# Altium project EEM_FMC_Carrier.PrjPCB (part 1 of 9)
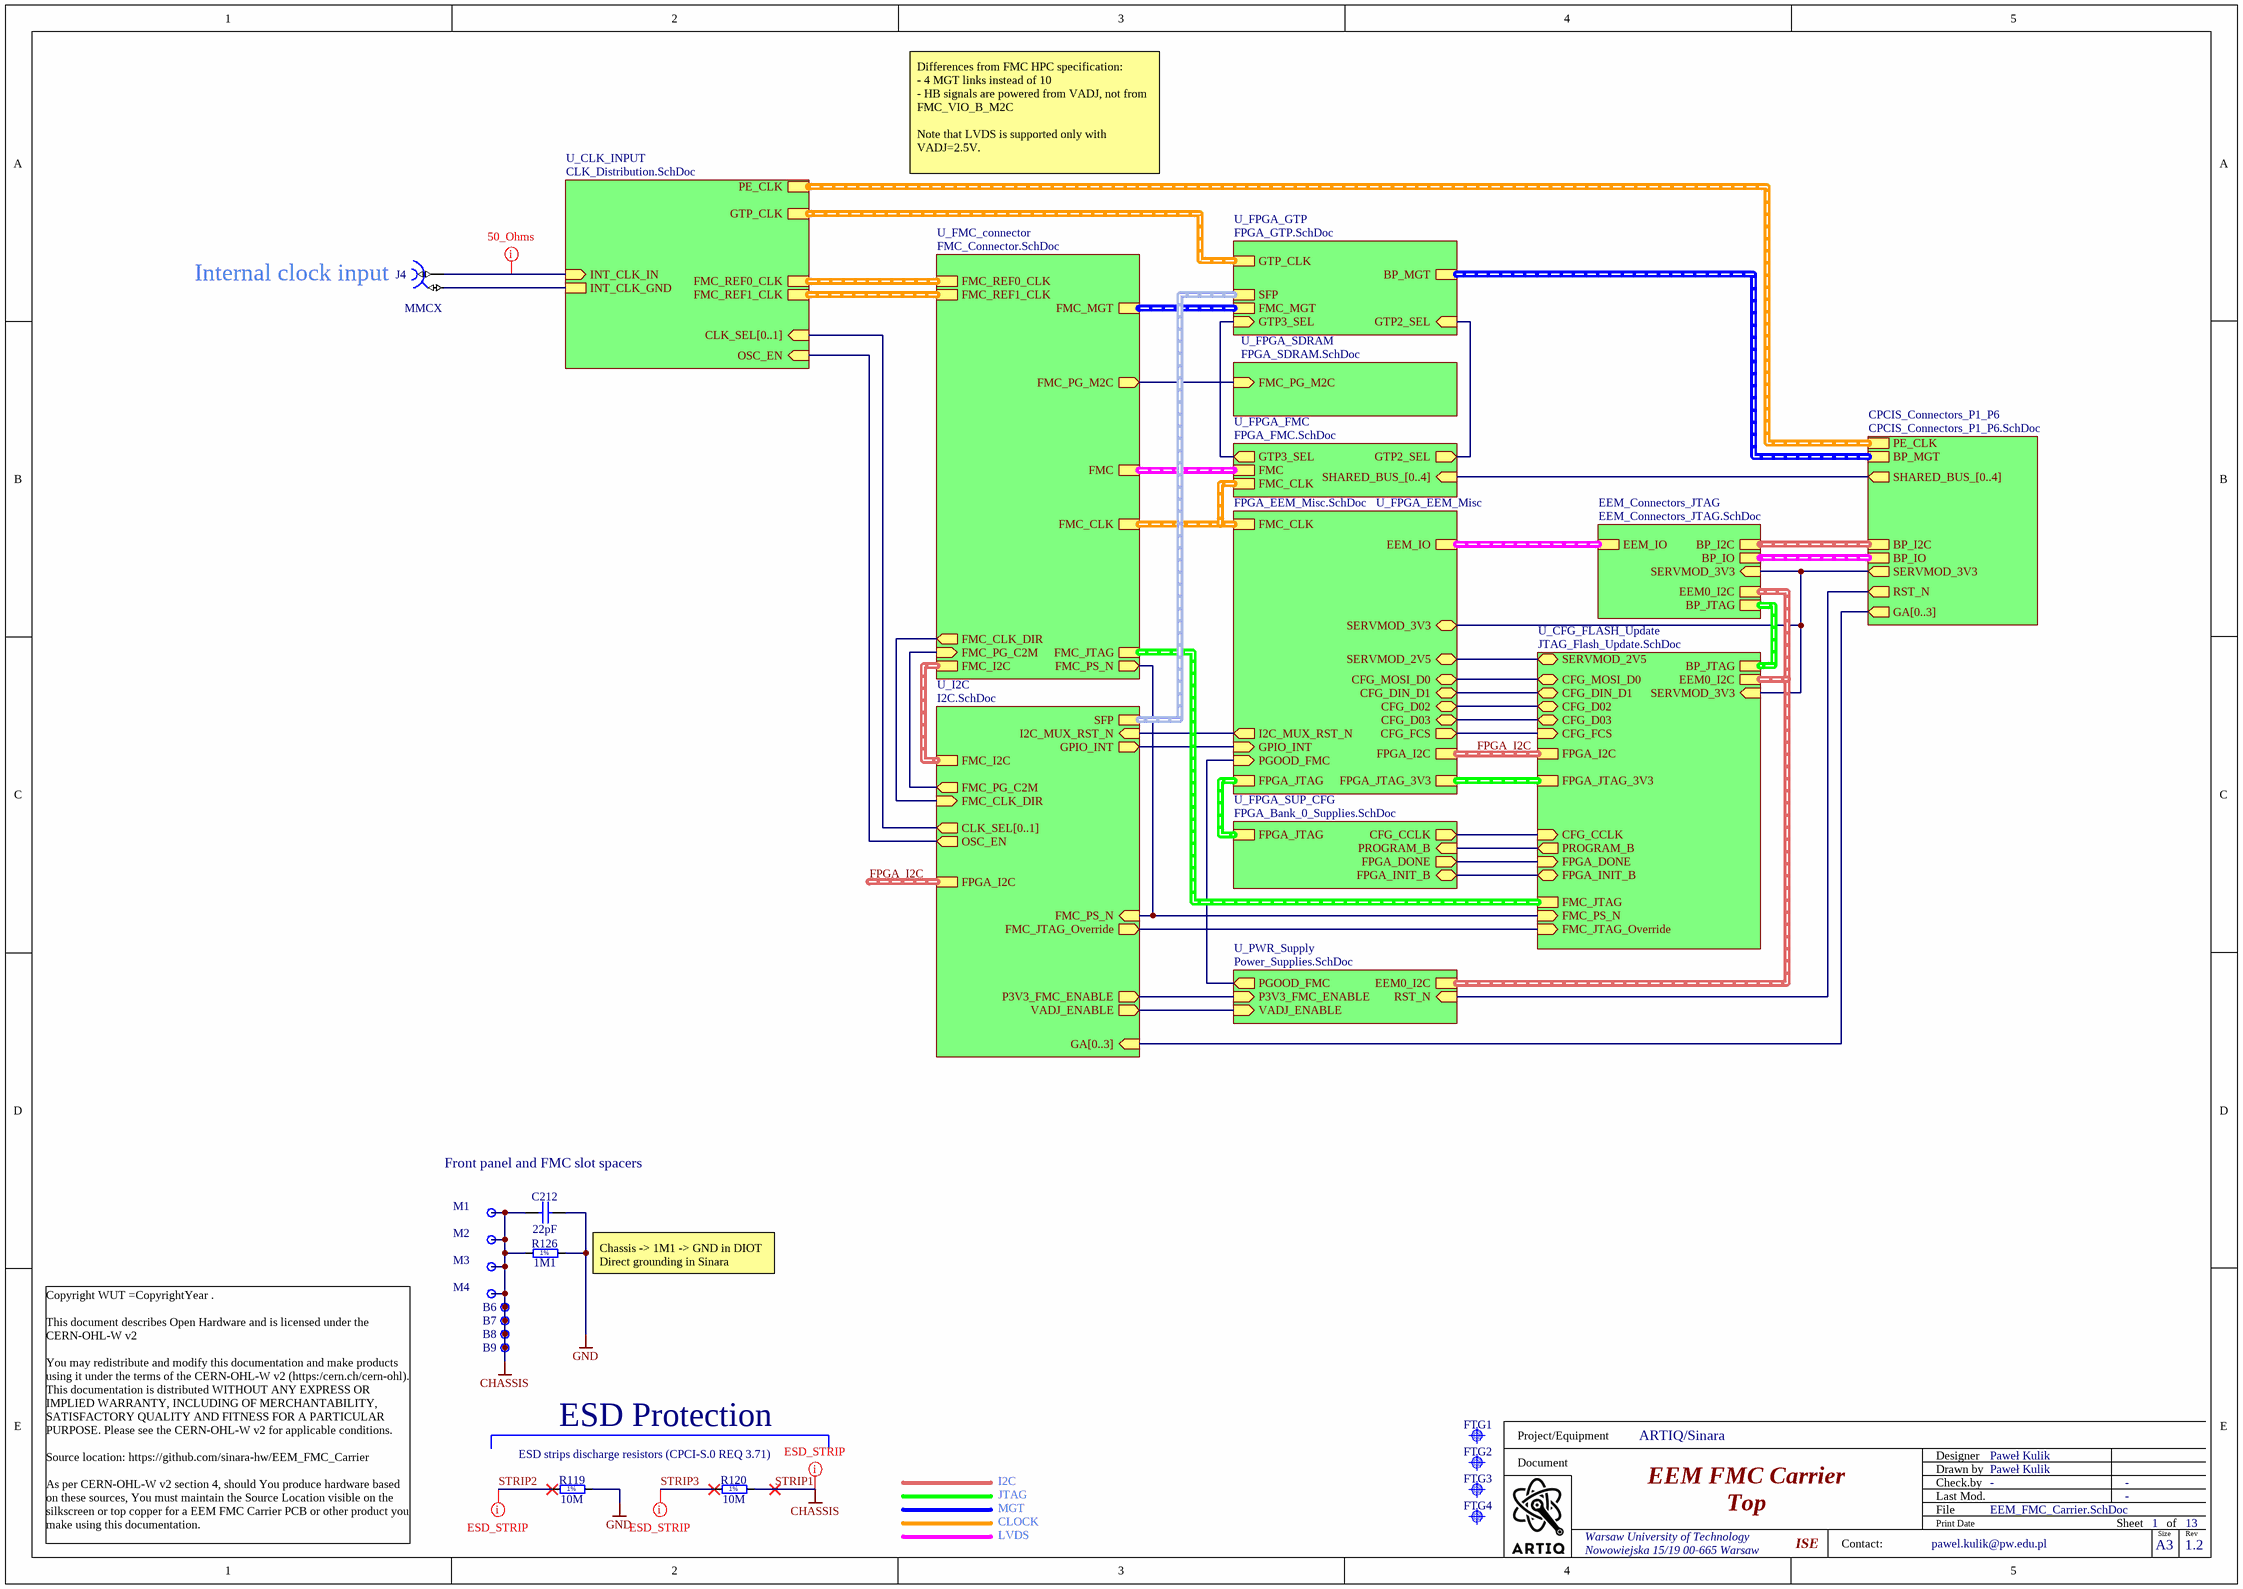
[diagram p0: EEM_FMC_Carrier.SchDoc]
CopyrightYear: 2025; Version: 1.2; Title: EEM FMC Carrier; SheetTotal: 13; P_version: 1.2; Projet: ARTIQ/Sinara; Project1: EEM FMC Carrier; DrawnBy: Paweł Kulik; DivGrp: ISE; Designer: Paweł Kulik; CheckedDate: -; CheckedBy: -; Address3: pawel.kulik@pw.edu.pl; Address2: Nowowiejska 15/19 00-665 Warsaw; Address1: Warsaw University of Technology
13 sheets, 778 parts. Net scope: hierarchical (ports join the sheet entries above them; power ports are global).
Board file: EEM_FMC_Carrier.PcbDoc
Sheets:
  EEM_FMC_Carrier.SchDoc
    U_FPGA_EEM_Misc = FPGA_EEM_Misc.SchDoc
    U_PWR_Supply = Power_Supplies.SchDoc
    U_CLK_INPUT = CLK_Distribution.SchDoc
    U_FPGA_FMC = FPGA_FMC.SchDoc
    U_FPGA_SUP_CFG = FPGA_Bank_0_Supplies.SchDoc
    U_FPGA_GTP = FPGA_GTP.SchDoc
    U_FPGA_SDRAM = FPGA_SDRAM.SchDoc
    U_CFG_FLASH_Update = JTAG_Flash_Update.SchDoc
    U_FMC_connector = FMC_Connector.SchDoc
    CPCIS_Connectors_P1_P6 = CPCIS_Connectors_P1_P6.SchDoc
    EEM_Connectors_JTAG = EEM_Connectors_JTAG.SchDoc
    U_I2C = I2C.SchDoc

## Sheet EEM_FMC_Carrier.SchDoc: EEM FMC Carrier
size 420 x 297 mm; EDA_Number: ARTIQ; Projet: ARTIQ/Sinara; CheckedBy: -; CompanyName: WUT ISE; DrawnBy: Paweł Kulik; Organization: WUT ISE; Address1: Warsaw University of Technology; Address2: Nowowiejska 15/19 00-665 Warsaw; Address3: pawel.kulik@pw.edu.pl; DocumentNumber: 1; SheetNumber: 1; SheetTotal: 13; CheckedDate: -; Title2: Top; DivGrp: ISE; Designer: Paweł Kulik; ModifiedDate: -

### Parts
B6  Plated Hole  [MTG270_500]  (value not drawn)  (no BOM)
B7  Plated Hole  [MTG270_500]  (value not drawn)  (no BOM)
B8  Plated Hole  [MTG270_500]  (value not drawn)  (no BOM)
B9  Plated Hole  [MTG270_500]  (value not drawn)  (no BOM)
C212  22pF  [CAPC1005X55N]
FTG1  Use only in PCB  [FIDUCIAL_TOP_C100-200]  (value not drawn)
FTG2  Use only in PCB  [FIDUCIAL_TOP_S100-200]  (value not drawn)
FTG3  Use only in PCB  [FIDUCIAL_TOP_S100-200]  (value not drawn)
FTG4  Use only in PCB  [FIDUCIAL_TOP_S100-200]  (value not drawn)
J4  MMCX  [SAMTEC_MMCX-J-P-H-ST-TH1]
M1  Plated Hole  [MTG300_600]  (value not drawn)  (no BOM)
M2  Plated Hole  [MTG300_600]  (value not drawn)  (no BOM)
M3  Plated Hole  [MTG300_600]  (value not drawn)  (no BOM)
M4  Plated Hole  [MTG300_600]  (value not drawn)  (no BOM)
R119  10M  [RESC2113X55N]
R120  10M  [RESC2113X55N]
R126  1M1  [RESC2012X60N]

### Sub-sheets
CPCIS_Connectors_P1_P6 = CPCIS_Connectors_P1_P6.SchDoc: BP_I2C (harness I2C), SERVMOD_3V3 (out), RST_N (out), PE_CLK (harness CLK_DIFF), BP_MGT (harness MGT), GA[0..3] (out), BP_IO (harness EEM_LVDS), SHARED_BUS_[0..4] (out)
EEM_Connectors_JTAG = EEM_Connectors_JTAG.SchDoc: BP_JTAG (harness JTAG5), EEM_IO (harness EEM_LVDS), BP_IO (harness EEM_LVDS), EEM0_I2C (harness I2C), BP_I2C (harness I2C), SERVMOD_3V3 (in)
U_CFG_FLASH_Update = JTAG_Flash_Update.SchDoc: CFG_MOSI_D0 (bidir), CFG_DIN_D1 (bidir), CFG_D02 (bidir), CFG_D03 (bidir), CFG_FCS (in), CFG_CCLK (in), FPGA_DONE (in), FPGA_INIT_B (bidir), PROGRAM_B (out), SERVMOD_3V3 (in), EEM0_I2C (harness I2C), FMC_PS_N (in), FMC_JTAG_Override (in), FPGA_JTAG_3V3 (harness JTAG5), BP_JTAG (harness JTAG5), FMC_JTAG (harness JTAG5), FPGA_I2C (harness I2C), SERVMOD_2V5 (bidir)
U_CLK_INPUT = CLK_Distribution.SchDoc: INT_CLK_IN (in), INT_CLK_GND, PE_CLK (harness CLK_DIFF), FMC_REF1_CLK (harness CLK_DIFF), FMC_REF0_CLK (harness CLK_DIFF), GTP_CLK (harness CLK_DIFF), CLK_SEL[0..1] (in), OSC_EN (in)
U_FMC_connector = FMC_Connector.SchDoc: FMC_REF1_CLK (harness CLK_DIFF), FMC_REF0_CLK (harness CLK_DIFF), FMC_CLK (harness FMC_CLK), FMC_PG_M2C (out), FMC_I2C (harness I2C), FMC_MGT (harness FMC_MGT), FMC_JTAG (harness JTAG5), FMC (harness FMC), FMC_PS_N (out), FMC_PG_C2M (in), FMC_CLK_DIR (out)
U_FPGA_EEM_Misc = FPGA_EEM_Misc.SchDoc: CFG_DIN_D1 (bidir), CFG_FCS (out), CFG_MOSI_D0 (bidir), CFG_D02 (bidir), CFG_D03 (bidir), FMC_CLK (harness FMC_CLK), EEM_IO (harness EEM_LVDS), FPGA_I2C (harness I2C), PGOOD_FMC (in), FPGA_JTAG (harness JTAG5), FPGA_JTAG_3V3 (harness JTAG5), SERVMOD_2V5 (bidir), SERVMOD_3V3 (bidir), I2C_MUX_RST_N (out), GPIO_INT (in)
U_FPGA_FMC = FPGA_FMC.SchDoc: FMC (harness FMC), FMC_CLK (harness FMC_CLK), SHARED_BUS_[0..4] (in), GTP3_SEL (out), GTP2_SEL (out)
U_FPGA_GTP = FPGA_GTP.SchDoc: FMC_MGT (harness FMC_MGT), BP_MGT (harness MGT), GTP_CLK (harness CLK_DIFF), GTP3_SEL (in), SFP (harness SFP), GTP2_SEL (in)
U_FPGA_SDRAM = FPGA_SDRAM.SchDoc: FMC_PG_M2C (in)
U_FPGA_SUP_CFG = FPGA_Bank_0_Supplies.SchDoc: FPGA_INIT_B (bidir), FPGA_DONE (out), CFG_CCLK (out), PROGRAM_B (in), FPGA_JTAG (harness JTAG5)
U_I2C = I2C.SchDoc: FMC_CLK_DIR (in), FMC_I2C (harness I2C), FMC_PS_N (in), FMC_PG_C2M (out), CLK_SEL[0..1] (out), GA[0..3] (in), FPGA_I2C (harness I2C), FMC_JTAG_Override (out), P3V3_FMC_ENABLE (out), VADJ_ENABLE (out), OSC_EN (out), SFP (harness SFP), I2C_MUX_RST_N (in), GPIO_INT (out)
U_PWR_Supply = Power_Supplies.SchDoc: RST_N (in), VADJ_ENABLE (in), P3V3_FMC_ENABLE (in), PGOOD_FMC (out), EEM0_I2C (harness I2C)

### Nets
GND: C212.2 R119.2 R126.2
STRIP1: B6.1 B7.1 B8.1 B9.1 C212.1 M1.1 M2.1 M3.1 M4.1 R120.2 R126.1  [also labelled CHASSIS]
CFG_CCLK: sheet U_FPGA_SUP_CFG/CFG_CCLK, sheet U_CFG_FLASH_Update/CFG_CCLK
CFG_D02: sheet U_FPGA_EEM_Misc/CFG_D02, sheet U_CFG_FLASH_Update/CFG_D02
CFG_D03: sheet U_FPGA_EEM_Misc/CFG_D03, sheet U_CFG_FLASH_Update/CFG_D03
CFG_DIN_D1: sheet U_FPGA_EEM_Misc/CFG_DIN_D1, sheet U_CFG_FLASH_Update/CFG_DIN_D1
CFG_FCS: sheet U_FPGA_EEM_Misc/CFG_FCS, sheet U_CFG_FLASH_Update/CFG_FCS
CFG_MOSI_D0: sheet U_FPGA_EEM_Misc/CFG_MOSI_D0, sheet U_CFG_FLASH_Update/CFG_MOSI_D0
FMC_CLK_DIR: sheet U_FMC_connector/FMC_CLK_DIR, sheet U_I2C/FMC_CLK_DIR
FMC_JTAG_Override: sheet U_CFG_FLASH_Update/FMC_JTAG_Override, sheet U_I2C/FMC_JTAG_Override
FMC_PG_C2M: sheet U_FMC_connector/FMC_PG_C2M, sheet U_I2C/FMC_PG_C2M
FMC_PG_M2C: sheet U_FPGA_SDRAM/FMC_PG_M2C, sheet U_FMC_connector/FMC_PG_M2C
FMC_PS_N: sheet U_CFG_FLASH_Update/FMC_PS_N, sheet U_FMC_connector/FMC_PS_N, sheet U_I2C/FMC_PS_N
FPGA_DONE: sheet U_FPGA_SUP_CFG/FPGA_DONE, sheet U_CFG_FLASH_Update/FPGA_DONE
FPGA_INIT_B: sheet U_FPGA_SUP_CFG/FPGA_INIT_B, sheet U_CFG_FLASH_Update/FPGA_INIT_B
GPIO_INT: sheet U_FPGA_EEM_Misc/GPIO_INT, sheet U_I2C/GPIO_INT
GTP2_SEL: sheet U_FPGA_FMC/GTP2_SEL, sheet U_FPGA_GTP/GTP2_SEL
GTP3_SEL: sheet U_FPGA_FMC/GTP3_SEL, sheet U_FPGA_GTP/GTP3_SEL
I2C_MUX_RST_N: sheet U_FPGA_EEM_Misc/I2C_MUX_RST_N, sheet U_I2C/I2C_MUX_RST_N
OSC_EN: sheet U_CLK_INPUT/OSC_EN, sheet U_I2C/OSC_EN
P3V3_FMC_ENABLE: sheet U_PWR_Supply/P3V3_FMC_ENABLE, sheet U_I2C/P3V3_FMC_ENABLE
PGOOD_FMC: sheet U_FPGA_EEM_Misc/PGOOD_FMC, sheet U_PWR_Supply/PGOOD_FMC
PROGRAM_B: sheet U_FPGA_SUP_CFG/PROGRAM_B, sheet U_CFG_FLASH_Update/PROGRAM_B
RST_N: sheet U_PWR_Supply/RST_N, sheet CPCIS_Connectors_P1_P6/RST_N
SERVMOD_2V5: sheet U_FPGA_EEM_Misc/SERVMOD_2V5, sheet U_CFG_FLASH_Update/SERVMOD_2V5
SERVMOD_3V3: sheet U_FPGA_EEM_Misc/SERVMOD_3V3, sheet U_CFG_FLASH_Update/SERVMOD_3V3, sheet CPCIS_Connectors_P1_P6/SERVMOD_3V3, sheet EEM_Connectors_JTAG/SERVMOD_3V3
STRIP2: R119.1
STRIP3: R120.1
VADJ_ENABLE: sheet U_PWR_Supply/VADJ_ENABLE, sheet U_I2C/VADJ_ENABLE
NetC3_1: J4.1 ; sheet U_CLK_INPUT/INT_CLK_IN
NetJ4_2: J4.2 ; sheet U_CLK_INPUT/INT_CLK_GND

### Buses and harness runs
bus sheet CPCIS_Connectors_P1_P6/GA[0..3] = sheet U_I2C/GA[0..3]
bus sheet CPCIS_Connectors_P1_P6/SHARED_BUS_[0..4] = sheet U_FPGA_FMC/SHARED_BUS_[0..4]
bus sheet U_CLK_INPUT/CLK_SEL[0..1] = sheet U_I2C/CLK_SEL[0..1]
harness FPGA_I2C = sheet U_CFG_FLASH_Update/FPGA_I2C = sheet U_FPGA_EEM_Misc/FPGA_I2C
harness FPGA_I2C = sheet U_I2C/FPGA_I2C
harness sheet CPCIS_Connectors_P1_P6/BP_I2C = sheet EEM_Connectors_JTAG/BP_I2C
harness sheet CPCIS_Connectors_P1_P6/BP_IO = sheet EEM_Connectors_JTAG/BP_IO
harness sheet CPCIS_Connectors_P1_P6/BP_MGT = sheet U_FPGA_GTP/BP_MGT
harness sheet CPCIS_Connectors_P1_P6/PE_CLK = sheet U_CLK_INPUT/PE_CLK
harness sheet EEM_Connectors_JTAG/BP_JTAG = sheet U_CFG_FLASH_Update/BP_JTAG
harness sheet EEM_Connectors_JTAG/EEM0_I2C = sheet U_CFG_FLASH_Update/EEM0_I2C = sheet U_PWR_Supply/EEM0_I2C
harness sheet EEM_Connectors_JTAG/EEM_IO = sheet U_FPGA_EEM_Misc/EEM_IO
harness sheet U_CFG_FLASH_Update/FMC_JTAG = sheet U_FMC_connector/FMC_JTAG
harness sheet U_CFG_FLASH_Update/FPGA_JTAG_3V3 = sheet U_FPGA_EEM_Misc/FPGA_JTAG_3V3
harness sheet U_CLK_INPUT/FMC_REF0_CLK = sheet U_FMC_connector/FMC_REF0_CLK
harness sheet U_CLK_INPUT/FMC_REF1_CLK = sheet U_FMC_connector/FMC_REF1_CLK
harness sheet U_CLK_INPUT/GTP_CLK = sheet U_FPGA_GTP/GTP_CLK
harness sheet U_FMC_connector/FMC = sheet U_FPGA_FMC/FMC
harness sheet U_FMC_connector/FMC_CLK = sheet U_FPGA_EEM_Misc/FMC_CLK = sheet U_FPGA_FMC/FMC_CLK
harness sheet U_FMC_connector/FMC_I2C = sheet U_I2C/FMC_I2C
harness sheet U_FMC_connector/FMC_MGT = sheet U_FPGA_GTP/FMC_MGT
harness sheet U_FPGA_EEM_Misc/FPGA_JTAG = sheet U_FPGA_SUP_CFG/FPGA_JTAG
harness sheet U_FPGA_GTP/SFP = sheet U_I2C/SFP

### Layout directives
net class 50Ohm: NetC3_1
net class ESD_STRIP: STRIP1, STRIP2, STRIP3

### Notes on the sheet
- Differences from FMC HPC specification:
  - 4 MGT links instead of 10
  - HB signals are powered from VADJ, not from FMC_VIO_B_M2C
  Note that LVDS is supported only with VADJ=2.5V.
- (near J4) Internal clock input
- Front panel and FMC slot spacers
- Chassis -> 1M1 -> GND in DIOT
  Direct grounding in Sinara
- ESD strips discharge resistors (CPCI-S.0 REQ 3.71)
- ESD Protection
- I2C
- JTAG
- MGT
- CLOCK
- LVDS
- Project/Equipment
- Document
- Designer
- Drawn by
- Check.by
- Copyright WUT =CopyrightYear .
  This document describes Open Hardware and is licensed under the CERN-OHL-W v2
  You may redistribute and modify this documentation and make products using it under the terms of the CERN-OHL-W v2 (https:/cern.ch/cern-ohl). This documentation is distributed WITHOUT ANY EXPRESS OR IMPLIED WARRANTY, INCLUDING OF MERCHANTABILITY, SATISFACTORY QUALITY AND FITNESS FOR A PARTICULAR PURPOSE. Please see the CERN-OHL-W v2 for applicable conditions.
  Source location: https://github.com/sinara-hw/EEM_FMC_Carrier
  As per CERN-OHL-W v2 section 4, should You produce hardware based on these sources, You must maintain the Source Location visible on the silkscreen or top copper for a EEM FMC Carrier PCB or other product you make using this documentation.
- Contact:
- File
- Last Mod.
- Print Date
- Sheet
- Size
- A3
- of
- Rev
- (in symbol R0805_1M1_1%_0.125W_100PPM) 1%
- (in symbol R0805_10M_1%_0.125W_100PPM_VISHAY_CRCW e3) 1%

### Library data of the parts
B6-B9 = PLATED_HOLE2.7_PAD5.0: Single Terminal Socket; Part Description: Plated Through Hole: Hole Dia.=2.7mm Pad Dia.=5.0mm; Mounted: No; Part Number: PLATED_HOLE2.7_PAD5.0; Component Type: Standard (No BOM); Pin Count: 1; Family: Plated Hole; Socket: No; SMD: No; Sense: No; Status: None; ComponentHeight: 0mm; HelpURL: Undefined; Author: CERN DEM JMW; CreateDate: 27.09.2011; LatestRevisionDate: 27.09.2011; PackageDescription: Plated Through Hole: Hole Dia.=2.7mm Pad Dia.=5.0mm
C212 = CC0402_22PF_50V_5%_C0G: Non-polarised capacitor; Part Description: SMD Multilayer Chip Ceramic Capacitor; Manufacturer: GENERIC; Manufacturer1 Part Number: C0402C220J5GACTU; Voltage: 50V; TC: C0G/NP0; Tolerance: ±5%; Part Number: CC0402_22PF_50V_5%_C0G; Component Kind: Standard; Component Type: Standard; Pin Count: 2; Value: 22pF; Status: Preferred; Manufacturer Part Number: CC0402_22PF_50V_5%_C0G; Case: 0402; Mounted: Yes; Socket: No; SMD: Yes; Manufacturer1 Example: KEMET; Manufacturer1 ComponentHeight: 0.55mm; HelpURL: \\cern.ch\dfs\Applications\Altium\Datasheets\CC0402_C0G_KEMET_(Commercial Grade).pdf; Author: CERN DEM JLC; CreateDate: 2007-12-03; LatestRevisionDate: 2007-12-03; Sense: No
FTG1 = FIDUCIAL_TARGET_C100-200: Fiducial Target; Part Description: Round Fiducial Target, Top Layer, 1.0mm, Top Solder 2.0mm, Keepout =2.0mm; Mounted: No; Part Number: FIDUCIAL_TARGET_C100-200; Component Kind: Standard (No BOM); Component Type: Standard (No BOM); Pin Count: 1; Family: Fiducial; Socket: No; SMD: Yes; Sense: No; Status: None; ComponentHeight: 0mm; HelpURL: Undefined; Author: CERN DEM JLC; CreateDate: 09.02.2010; LatestRevisionDate: 04.04.2012; PackageDescription: Round Fiducial Target, Top Layer, 1.0mm, Top Solder 2.0mm, Keepout =2.0mm
FTG2-FTG4 = FIDUCIAL_TARGET_S100-200: Fiducial Target; Part Description: Square Fiducial Target, Top Layer, 1.0mm, Top Solder 2.0mm, Keepout =2.0mm; Mounted: No; Part Number: FIDUCIAL_TARGET_S100-200; Component Kind: Standard (No BOM); Component Type: Standard (No BOM); Pin Count: 1; Family: Fiducial; Socket: No; SMD: Yes; Sense: No; Status: None; ComponentHeight: 0mm; HelpURL: Undefined; Author: CERN DEM JLC; CreateDate: 09.02.2010; LatestRevisionDate: 04.04.2012; PackageDescription: Square Fiducial Target, Top Layer, 1.0mm, Top Solder 2.0mm, Keepout =2.0mm
J4 = SAMTEC_MMCX-J-P-H-ST-TH1: Part Description: Straight Through-hole 50 Ohm Micro Mini RF Jack, MMCX Series; Manufacturer: SAMTEC; PressFit: No; Part Number: SAMTEC_MMCX-J-P-H-ST-TH1; Component Kind: Standard; Component Type: Standard; Pin Count: 2; Mounted: Yes; Socket: No; Sense: No; SMD: No; Status: None; Manufacturer Part Number: MMCX-J-P-H-ST-TH1; ComponentHeight: 4.35mm; HelpURL: \\cern.ch\dfs\Applications\Altium\Datasheets\SAMTEC_MMCX-J-P-H-ST-TH1.pdf; Author: CERN DEM JLC; CreateDate: 05.12.2012; LatestRevisionDate: 05.12.2012
M1-M4 = PLATED_HOLE3.0_PAD6.0: Single Terminal Socket; Part Description: Plated Through Hole: Hole Dia.=3.0mm Pad Dia.=6.0mm; Mounted: No; Table: Pads; Part Number: PLATED_HOLE3.0_PAD6.0; Component Type: Standard (No BOM); Designator: Single Terminal Socket; Library Reference: Single Terminal Socket; Pin Count: 1; Family: Plated Hole; Socket: No; SMD: No; Status: None; ComponentHeight: 0mm; Author: CERN DEM JLC; CreateDate: 26.05.2008; LatestRevisionDate: 26.05.2008; PackageDescription: Plated Through Hole: Hole Dia.=3.0mm Pad Dia.=6.0mm
R119 R120 = R0805_10M_1%_0.125W_100PPM_VISHAY_CRCW e3: Resistor - 1%; Part Description: 150V, Standard Thick Film Chip Resistor; Manufacturer: VISHAY DALE; Manufacturer Part Number: CRCW080510M0FKEA; Power: 0.125W; TC: ±100ppm/°C; PressFit: No; Part Number: R0805_10M_1%_0.125W_100PPM_VISHAY_CRCW e3; Component Kind: Standard; Component Type: Standard; Pin Count: 2; Value: 10M; Status: None; Tolerance: ±1%; Case: 0805; Mounted: Yes; Sense: No; Socket: No; SMD: Yes; ComponentHeight: 0.5mm; HelpURL: \\cern.ch\dfs\Applications\Altium\Datasheets\R0805_VISHAY_CRCW e3.pdf; Author: CERN DEM BC; CreateDate: 2019-11-12; LatestRevisionDate: 2019-11-12
R126 = R0805_1M1_1%_0.125W_100PPM: Resistor - 1%; Part Description: General Purpose Thick Film Chip Resistor; Manufacturer: GENERIC; Manufacturer1 Part Number: NRC10F1104TRF; PressFit: No; Part Number: R0805_1M1_1%_0.125W_100PPM; Component Kind: Standard; Component Type: Standard; Pin Count: 2; Value: 1M1; Status: Preferred; Manufacturer Part Number: R0805_1M1_1%_0.125W_100PPM; Case: 0805; Mounted: Yes; Sense: No; Socket: No; SMD: Yes; Manufacturer1 Example: NIC COMPONENT; Manufacturer1 ComponentHeight: 0.6mm; HelpURL: \\cern.ch\dfs\Applications\Altium\Datasheets\R0805_NIC_NRC.pdf; Author: CERN DEM JLC; CreateDate: 03/12/2007; LatestRevisionDate: 13/03/2008

## Sheet FPGA_EEM_Misc.SchDoc: EEM FMC Carrier
size 420 x 297 mm; EDA_Number: ARTIQ; Projet: ARTIQ/Sinara; CheckedBy: -; CompanyName: WUT ISE; DrawnBy: Paweł Kulik; Organization: WUT ISE; Address1: Warsaw University of Technology; Address2: Nowowiejska 15/19 00-665 Warsaw; Address3: pawel.kulik@pw.edu.pl; DocumentNumber: 18; SheetNumber: 6; SheetTotal: 13; ModifiedBy: -; CheckedDate: -; Title2: FPGA EEM/BP + MISC; DivGrp: ISE; Designer: Paweł Kulik; ModifiedDate: -; ProjectName: EEM_FMC_Carrier.PrjPCB
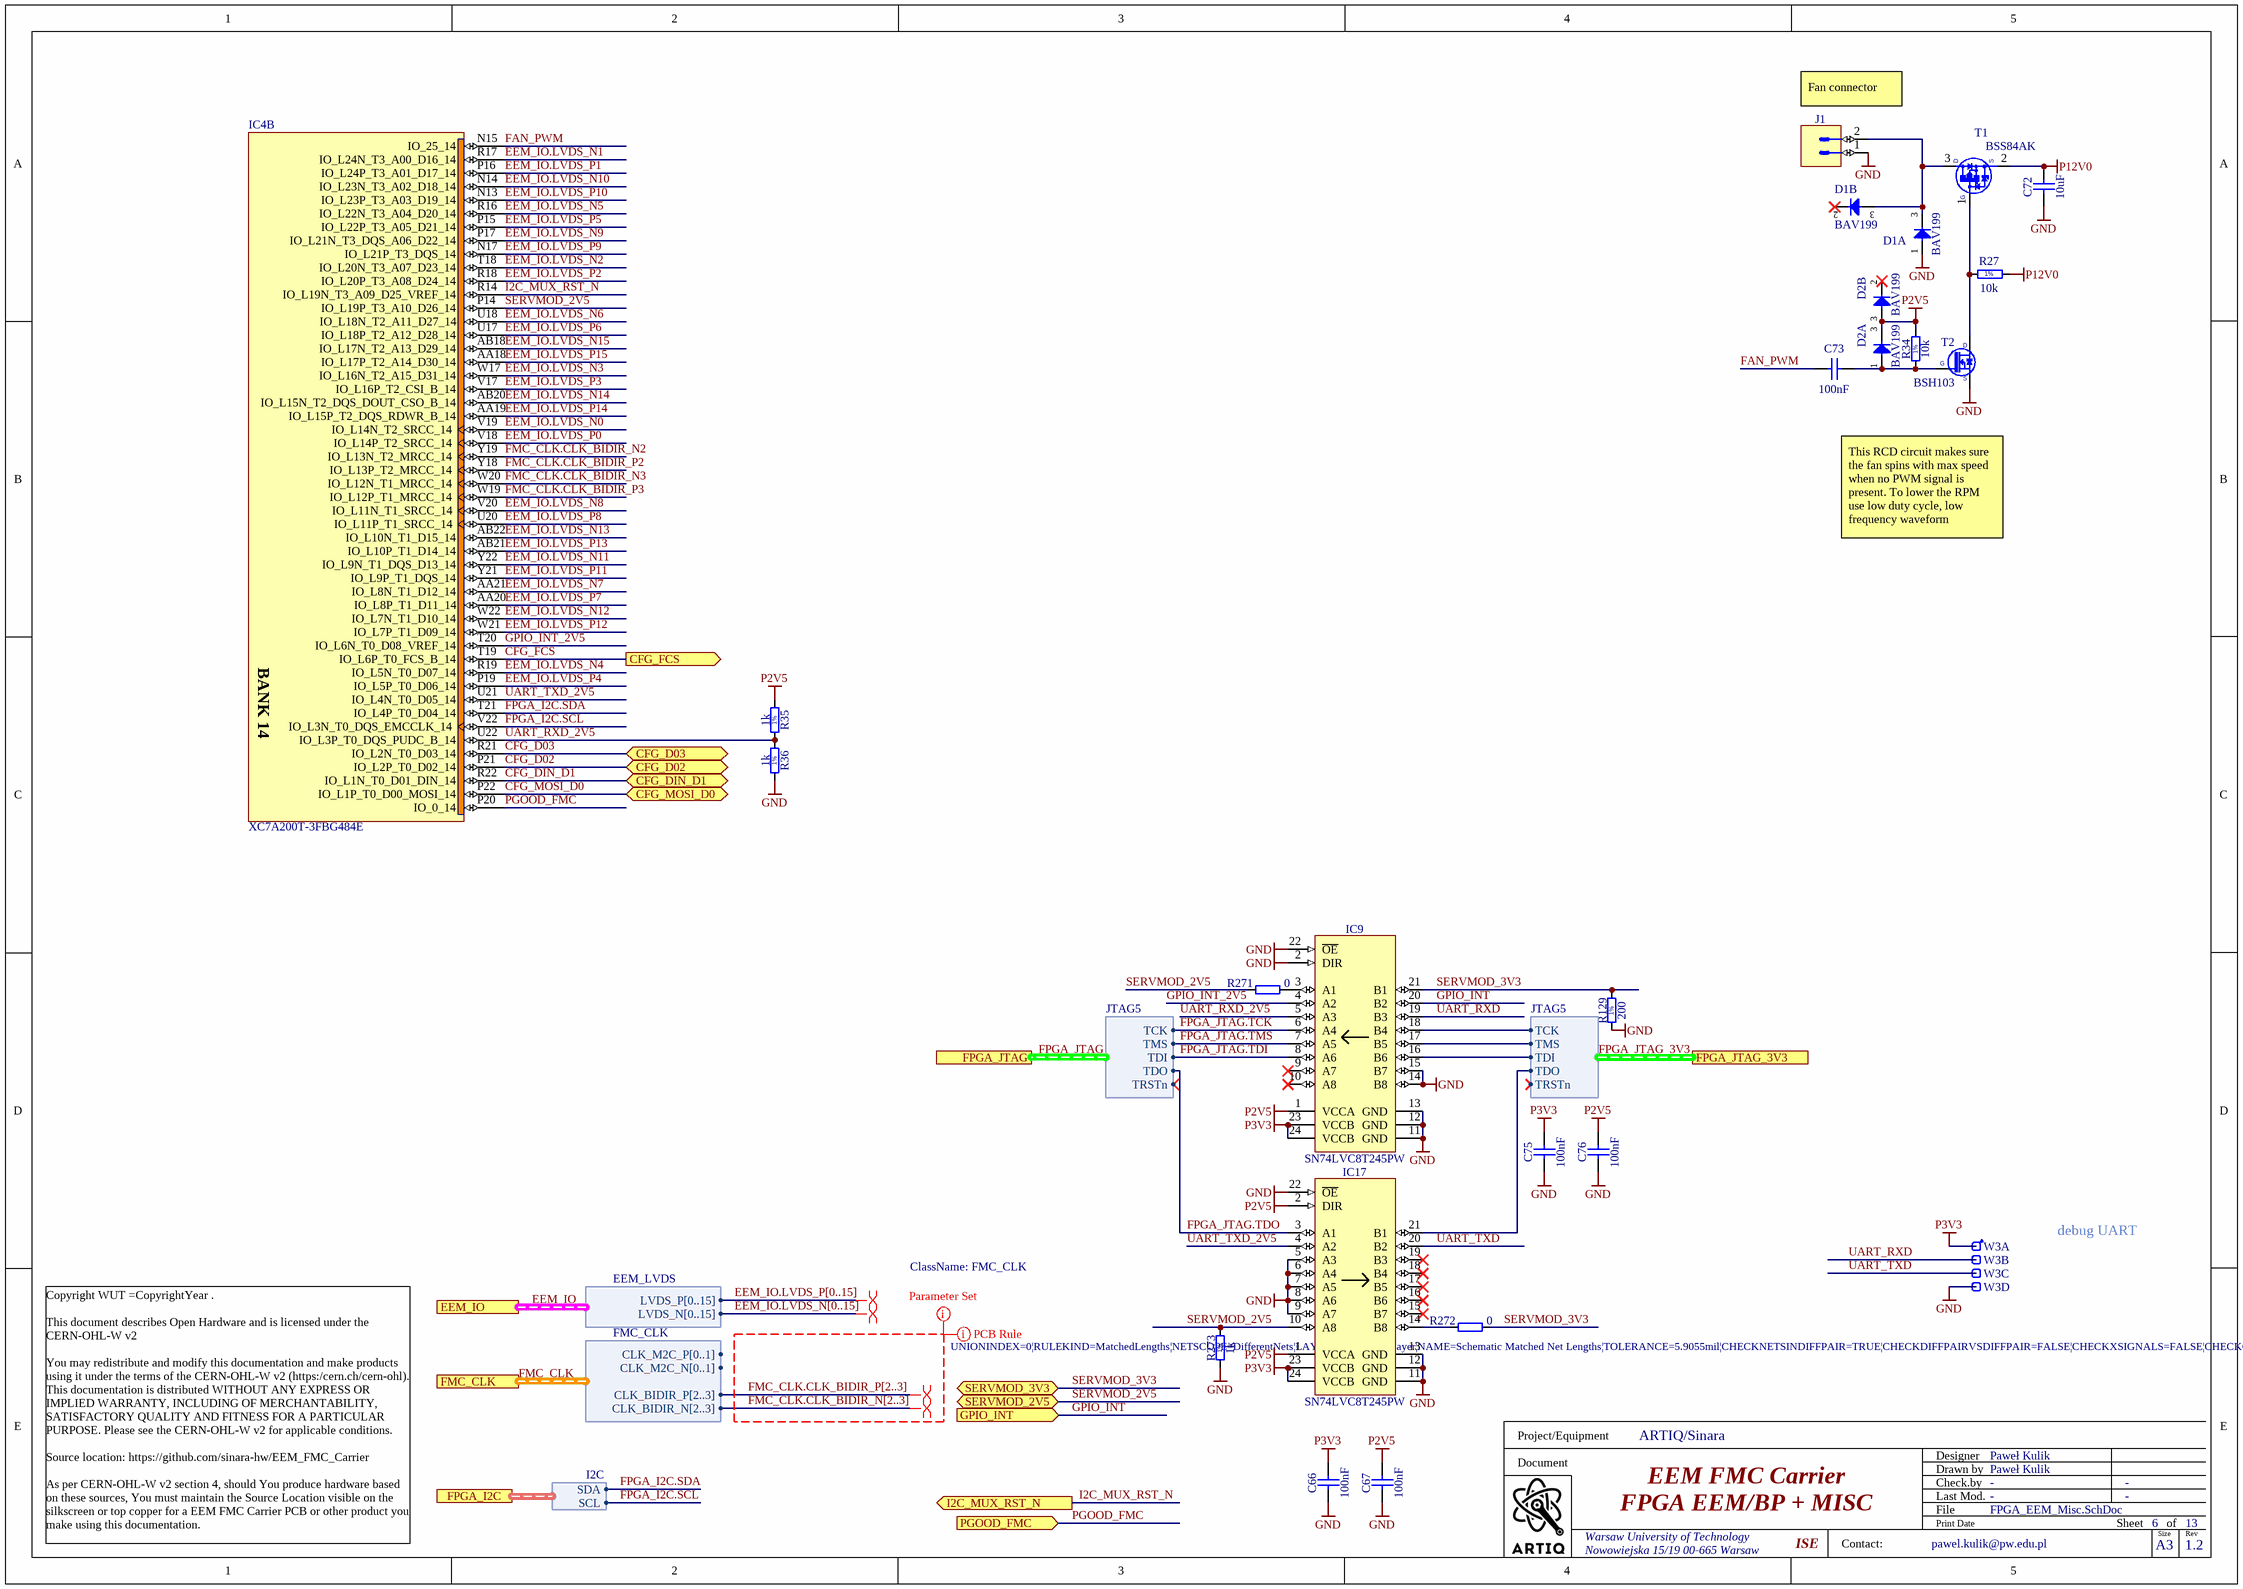
[diagram p1: FPGA_EEM_Misc.SchDoc]

### Parts
(Parts that share a designator on the sheet are numbered #1, #2 ... from top to bottom, then left to right.)
C66#1  100nF  [CAPC1005X55N]
C67#1  100nF  [CAPC1005X55N]
C72  10uF  [CAPC2012X95N]
C73  100nF  [CAPC0603X33N]
C75  100nF  [CAPC1005X55N]
C76  100nF  [CAPC1005X55N]
D1  BAV199  [SOT95P240X110-3N]  (parts A,B of 2)
D2  BAV199  [SOT95P240X110-3N]  (parts A,B of 2)
IC4  XC7A200T-3FBG484E  [BGA484C100P22X22_2300X2300X254]  (part B of 10)
IC9  SN74LVC8T245PW  [SOP65P640X120-24N]
IC17  SN74LVC8T245PW  [SOP65P640X120-24N]
J1  KK®  [MOLEX_22-27-2021]  (value not drawn)
R27  10k  [RESC1005X40N]
R34  10k  [RESC1005X40N]
R35  1k  [RESC1005X40N]
R36  1k  [RESC1005X40N]
R129  200  [RESC1005X40N]
R271  0  [RESC1005X40N]
R272  0  [RESC1005X40N]
R273  1k  [RESC1005X40N]
T1  BSS84AK  [SOT95P230X110-3N]
T2  BSH103  [SOT95P230X110-3N]
W3  Header 4  [SAMTEC_HTSW-104-23-L-S]  (value not drawn)  (parts A,B,C,D of 4)

### Ports
CFG_D02 (bidir), CFG_D03 (bidir), CFG_DIN_D1 (bidir), CFG_FCS (out), CFG_MOSI_D0 (bidir), EEM_IO (harness EEM_LVDS), FMC_CLK (harness FMC_CLK), FPGA_I2C (harness I2C), FPGA_JTAG (harness JTAG5), FPGA_JTAG_3V3 (harness JTAG5), GPIO_INT (in), I2C_MUX_RST_N (out), PGOOD_FMC (in), SERVMOD_2V5 (bidir), SERVMOD_3V3 (bidir)

### Harnesses
FMC_CLK: CLK_M2C_P[0..1], CLK_M2C_N[0..1], CLK_BIDIR_P[2..3], CLK_BIDIR_N[2..3]
EEM_LVDS: LVDS_P[0..15], LVDS_N[0..15]
I2C: SDA, SCL
JTAG5: TCK, TDI, TDO, TMS, TRSTn

### Nets
GND: C66#1.1 C67#1.1 C72.1 C75.1 C76.1 D1.1(A) IC9.2(DIR) IC9.11(GND) IC9.12(GND) IC9.13(GND) IC9.14(B8) IC9.15(B7) IC9.22(~{OE}) IC17.5(A3) IC17.6(A4) IC17.7(A5) IC17.8(A6) IC17.9(A7) IC17.11(GND) IC17.12(GND) IC17.13(GND) IC17.22(~{OE}) J1.1 R36.1 R129.1 R273.1 T2.2(S) W3.4
P2V5: C67#1.2 C76.2 D2.3(COMAC) IC9.1(VCCA) IC17.1(VCCA) IC17.2(DIR) R34.2 R35.2
P3V3: C66#1.2 C75.2 IC9.23(VCCB) IC9.24(VCCB) IC17.23(VCCB) IC17.24(VCCB) W3.1
P12V0: C72.2 R27.2 T1.2(S)
CFG_D02: IC4.P21(IO_L2P_T0_D02_14) ; port CFG_D02
CFG_D03: IC4.R21(IO_L2N_T0_D03_14) ; port CFG_D03
CFG_DIN_D1: IC4.R22(IO_L1N_T0_D01_DIN_14) ; port CFG_DIN_D1
CFG_FCS: IC4.T19(IO_L6P_T0_FCS_B_14) ; port CFG_FCS
CFG_MOSI_D0: IC4.P22(IO_L1P_T0_D00_MOSI_14) ; port CFG_MOSI_D0
EEM_IO.LVDS_N0: IC4.V19(IO_L14N_T2_SRCC_14)
EEM_IO.LVDS_N1: IC4.R17(IO_L24N_T3_A00_D16_14)
EEM_IO.LVDS_N2: IC4.T18(IO_L20N_T3_A07_D23_14)
EEM_IO.LVDS_N3: IC4.W17(IO_L16N_T2_A15_D31_14)
EEM_IO.LVDS_N4: IC4.R19(IO_L5N_T0_D07_14)
EEM_IO.LVDS_N5: IC4.R16(IO_L22N_T3_A04_D20_14)
EEM_IO.LVDS_N6: IC4.U18(IO_L18N_T2_A11_D27_14)
EEM_IO.LVDS_N7: IC4.AA21(IO_L8N_T1_D12_14)
EEM_IO.LVDS_N8: IC4.V20(IO_L11N_T1_SRCC_14)
EEM_IO.LVDS_N9: IC4.P17(IO_L21N_T3_DQS_A06_D22_14)
EEM_IO.LVDS_N10: IC4.N14(IO_L23N_T3_A02_D18_14)
EEM_IO.LVDS_N11: IC4.Y22(IO_L9N_T1_DQS_D13_14)
EEM_IO.LVDS_N12: IC4.W22(IO_L7N_T1_D10_14)
EEM_IO.LVDS_N13: IC4.AB22(IO_L10N_T1_D15_14)
EEM_IO.LVDS_N14: IC4.AB20(IO_L15N_T2_DQS_DOUT_CSO_B_14)
EEM_IO.LVDS_N15: IC4.AB18(IO_L17N_T2_A13_D29_14)
EEM_IO.LVDS_P0: IC4.V18(IO_L14P_T2_SRCC_14)
EEM_IO.LVDS_P1: IC4.P16(IO_L24P_T3_A01_D17_14)
EEM_IO.LVDS_P2: IC4.R18(IO_L20P_T3_A08_D24_14)
EEM_IO.LVDS_P3: IC4.V17(IO_L16P_T2_CSI_B_14)
EEM_IO.LVDS_P4: IC4.P19(IO_L5P_T0_D06_14)
EEM_IO.LVDS_P5: IC4.P15(IO_L22P_T3_A05_D21_14)
EEM_IO.LVDS_P6: IC4.U17(IO_L18P_T2_A12_D28_14)
EEM_IO.LVDS_P7: IC4.AA20(IO_L8P_T1_D11_14)
EEM_IO.LVDS_P8: IC4.U20(IO_L11P_T1_SRCC_14)
EEM_IO.LVDS_P9: IC4.N17(IO_L21P_T3_DQS_14)
EEM_IO.LVDS_P10: IC4.N13(IO_L23P_T3_A03_D19_14)
EEM_IO.LVDS_P11: IC4.Y21(IO_L9P_T1_DQS_14)
EEM_IO.LVDS_P12: IC4.W21(IO_L7P_T1_D09_14)
EEM_IO.LVDS_P13: IC4.AB21(IO_L10P_T1_D14_14)
EEM_IO.LVDS_P14: IC4.AA19(IO_L15P_T2_DQS_RDWR_B_14)
EEM_IO.LVDS_P15: IC4.AA18(IO_L17P_T2_A14_D30_14)
FAN_PWM: C73.2 IC4.N15(IO_25_14)
FMC_CLK.CLK_BIDIR_N2: IC4.Y19(IO_L13N_T2_MRCC_14)
FMC_CLK.CLK_BIDIR_N3: IC4.W20(IO_L12N_T1_MRCC_14)
FMC_CLK.CLK_BIDIR_P2: IC4.Y18(IO_L13P_T2_MRCC_14)
FMC_CLK.CLK_BIDIR_P3: IC4.W19(IO_L12P_T1_MRCC_14)
FPGA_I2C.SCL: IC4.V22(IO_L3N_T0_DQS_EMCCLK_14) ; port FPGA_I2C.SCL
FPGA_I2C.SDA: IC4.T21(IO_L4P_T0_D04_14) ; port FPGA_I2C.SDA
FPGA_JTAG.TCK: IC9.6(A4) ; port FPGA_JTAG.TCK
FPGA_JTAG.TDI: IC9.8(A6) ; port FPGA_JTAG.TDI
FPGA_JTAG.TDO: IC17.3(A1) ; port FPGA_JTAG.TDO
FPGA_JTAG.TMS: IC9.7(A5) ; port FPGA_JTAG.TMS
FPGA_JTAG_3V3.TCK: IC9.18(B4) ; port FPGA_JTAG_3V3.TCK
FPGA_JTAG_3V3.TDI: IC9.16(B6) ; port FPGA_JTAG_3V3.TDI
FPGA_JTAG_3V3.TDO: IC17.21(B1) ; port FPGA_JTAG_3V3.TDO
FPGA_JTAG_3V3.TMS: IC9.17(B5) ; port FPGA_JTAG_3V3.TMS
GPIO_INT: IC9.20(B2) ; port GPIO_INT
GPIO_INT_2V5: IC4.T20(IO_L6N_T0_D08_VREF_14) IC9.4(A2)
I2C_MUX_RST_N: IC4.R14(IO_L19N_T3_A09_D25_VREF_14) ; port I2C_MUX_RST_N
PGOOD_FMC: IC4.P20(IO_0_14) ; port PGOOD_FMC
SERVMOD_2V5: IC4.P14(IO_L19P_T3_A10_D26_14) IC17.10(A8) R271.2 R273.2 ; port SERVMOD_2V5
SERVMOD_3V3: IC9.21(B1) R129.2 R272.1 ; port SERVMOD_3V3
UART_RXD: IC9.19(B3) W3.2
UART_RXD_2V5: IC4.U22(IO_L3P_T0_DQS_PUDC_B_14) IC9.5(A3) R35.1 R36.2
UART_TXD: IC17.20(B2) W3.3
UART_TXD_2V5: IC4.U21(IO_L4N_T0_D05_14) IC17.4(A2)
NetC73_1: C73.1 D2.1(A) R34.1 T2.1(G)
NetD1_3: D1.3(COMAC) J1.2 T1.3(D)
NetIC9_3: IC9.3(A1) R271.1
NetIC17_14: IC17.14(B8) R272.2
NetR27_1: R27.1 T1.1(G) T2.3(D)

Not connected (* = marked no-connect by the designer): D1 2(C)*; D2 2(C)*; IC9 9(A7)* 10(A8)*; IC17 15(B7)* 16(B6)* 17(B5)* 18(B4)* 19(B3)*

### Buses and harness runs
bus EEM_IO.LVDS_N[0..15]
bus EEM_IO.LVDS_P[0..15]
bus FMC_CLK.CLK_BIDIR_N[2..3]
bus FMC_CLK.CLK_BIDIR_P[2..3]
harness EEM_IO = port EEM_IO
harness FMC_CLK = port FMC_CLK
harness FPGA_JTAG = port FPGA_JTAG
harness FPGA_JTAG_3V3 = port FPGA_JTAG_3V3

### Layout directives
net class FMC_CLK: FMC_CLK.CLK_BIDIR_N[2..3], FMC_CLK.CLK_BIDIR_P[2..3]
rule Matched Net Lengths [Delay Tolerance = 11ps]: FMC_CLK.CLK_BIDIR_N[2..3], FMC_CLK.CLK_BIDIR_P[2..3]
differential pair: (no net found under the mark), FMC_CLK.CLK_BIDIR_N[2..3], FMC_CLK.CLK_BIDIR_P[2..3]

### Notes on the sheet
- (near J1) Fan connector
- This RCD circuit makes sure the fan spins with max speed when no PWM signal is present. To lower the RPM use low duty cycle, low frequency waveform
- (near W3) debug UART
- Project/Equipment
- Document
- Designer
- Drawn by
- Check.by
- Copyright WUT =CopyrightYear .
  This document describes Open Hardware and is licensed under the CERN-OHL-W v2
  You may redistribute and modify this documentation and make products using it under the terms of the CERN-OHL-W v2 (https:/cern.ch/cern-ohl). This documentation is distributed WITHOUT ANY EXPRESS OR IMPLIED WARRANTY, INCLUDING OF MERCHANTABILITY, SATISFACTORY QUALITY AND FITNESS FOR A PARTICULAR PURPOSE. Please see the CERN-OHL-W v2 for applicable conditions.
  Source location: https://github.com/sinara-hw/EEM_FMC_Carrier
  As per CERN-OHL-W v2 section 4, should You produce hardware based on these sources, You must maintain the Source Location visible on the silkscreen or top copper for a EEM FMC Carrier PCB or other product you make using this documentation.
- Contact:
- File
- Last Mod.
- Print Date
- Sheet
- Size
- A3
- of
- Rev
- (in symbol R0402_1K_1%_0.0625W_100PPM) 1%
- (in symbol R0402_10K_1%_0.0625W_100PPM) 1%
- (in symbol R0402_200R_1%_0.0625W_100PPM) 1%
- (in symbol XC7A200T-3FBG484E, part B) BANK 14

### Library data of the parts
C66#1 C67#1 C75 C76 = CC0402_100NF_25V_10%_X7R_YUDEN_TMK105B7104KVHF: Non-polarised capacitor; Part Description: SMD Multilayer Chip Ceramic Capacitor (High Dielectric Type) for Automotive / Industrial Applications; Manufacturer: TAIYO YUDEN; Voltage: 25V; TC: X7R; Tolerance: ±10%; Part Number: CC0402_100NF_25V_10%_X7R_YUDEN_TMK105B7104KVHF; Component Kind: Standard; Component Type: Standard; Pin Count: 2; Value: 100nF; Status: Not Recommended; Manufacturer Part Number: TMK105B7104KVHF; Case: 0402; Mounted: Yes; Socket: No; SMD: Yes; Sense: No; HelpURL: \\cern.ch\dfs\Applications\Altium\Datasheets\CC0402_TAIYO-YUDEN_TMK105B7104KVHF.pdf; Author: CERN DEM JLC; CreateDate: 10-May-17; LatestRevisionDate: 10-May-17; ComponentHeight: 0.55mm
C72 = CC0805_10UF_25V_10%_X5R: Non-polarised capacitor; Part Description: SMD Multilayer Chip Ceramic Capacitor; Manufacturer: GENERIC; Manufacturer1 Part Number: GRM219R61E106KA12D; Voltage: 25V; TC: X5R; Tolerance: ±10%; Part Number: CC0805_10UF_25V_10%_X5R; Component Kind: Standard; Component Type: Standard; Pin Count: 2; Value: 10uF; Status: Preferred; Manufacturer Part Number: CC0805_10UF_25V_10%_X5R; Case: 0805; Mounted: Yes; Socket: No; SMD: Yes; Manufacturer1 Example: MURATA; Manufacturer1 ComponentHeight: 0.95mm; HelpURL: \\cern.ch\dfs\Applications\Altium\Datasheets\CC0805_X5R_MURATA_GRM.pdf; Author: CERN DEM JLC; CreateDate: 25.10.2012; LatestRevisionDate: 06.09.2016; Sense: No
C73 = CC0201_100NF_6.3V_10%_X5R: Non-polarised capacitor; Part Description: SMD Multilayer Chip Ceramic Capacitor; Manufacturer: GENERIC; Manufacturer1 Part Number: 02016D104KAT2A; Voltage: 6.3V; TC: X5R; Tolerance: ±10%; Part Number: CC0201_100NF_6.3V_10%_X5R; Component Kind: Standard; Component Type: Standard; Pin Count: 2; Value: 100nF; Status: Not Recommended; Manufacturer Part Number: CC0201_100NF_6.3V_10%_X5R; Case: 0201; Mounted: Yes; Socket: No; SMD: Yes; Sense: No; Manufacturer1 Example: AVX; Manufacturer1 ComponentHeight: 0.33mm; HelpURL: \\cern.ch\dfs\Applications\Altium\Datasheets\CC0201_X5R_AVX.pdf; Author: CERN DEM JLC; CreateDate: 2007-12-03; LatestRevisionDate: 2007-12-03; ClassName: FPGA_JTAG
D1 D2 = BAV199: Serial Diode; Part Description: Low-Leakage Double Diode; Manufacturer: NXP SEMICONDUCTORS; Voltage: 75V; Power: 250mW; PressFit: No; Bonding: No; Part Number: BAV199; Component Kind: Standard; Component Type: Standard; Device: BAV199; PackageDescription: SOT23 3-Leads, Pitch 0.95mm - Body 1.4x3mm, IPC Medium Density; Manufacturer Part Number: BAV199; Pin Count: 3; Case: SOT23-3; Mounted: Yes; Socket: No; SMD: Yes; Sense: No; ComponentHeight: 1.1mm; HelpURL: \\cern.ch\dfs\Applications\Altium\Datasheets\BAV199.pdf; Author: CERN DEM JMW; CreateDate: 2008-11-21; LatestRevisionDate: 2008-11-21
IC4 = XC7A200T-3FBG484E: Artix-7 FPGA, 285 User I/Os, 4 GTP, 484-Ball BGA, Pb-Free; Manufacturer Part Number: XC7A200T-3FBG484E; Device: XC7A200T-3FBG484E
IC9 IC17 = SN74LVC8T245PW: 8-Bit Dual-Supply Bus Transceiver With Configurable Voltage Translation and 3-State Outputs; Manufacturer: TEXAS INSTRUMENTS; PressFit: No; Bonding: No; Part Number: SN74LVC8T245PW; Component Kind: Standard; Component Type: Standard; Device: SN74LVC8T245PW; PackageDescription: SOP, 0.65mm Pitch; 24 Pin, 4.40mm W X 7.80mm L X 1.20mm H Body, IPC Medium Density; Part Description: 8-Bit Dual-Supply Bus Transceiver With Configurable Voltage Translation and 3-State Outputs; Manufacturer Part Number: SN74LVC8T245PW; Pin Count: 24; Case: TSSOP24; Mounted: Yes; Socket: No; SMD: Yes; Sense: No; ComponentHeight: 1.2mm; Author: CERN DEM JLC; HelpURL: \\cern.ch\dfs\Applications\Altium\Datasheets\SN74LVC8T245PW.pdf; CreateDate: 02.09.2009; LatestRevisionDate: 02.09.2009
J1 = MOLEX_22-27-2021: Connector 2 Male; Part Description: 2.54mm (.100") Pitch KK® Wire-to-Board Header, Vertical, with Friction Lock, 2 Circuits, Tin (Sn) Plating; Manufacturer: MOLEX; PressFit: No; Part Number: MOLEX_22-27-2021; Component Kind: Standard; Component Type: Standard; Pin Count: 2; Family: KK®; Mounted: Yes; Socket: No; SMD: No; Sense: No; Status: None; Manufacturer Part Number: 22-27-2021; ComponentHeight: 11.7mm; HelpURL: \\cern.ch\dfs\Applications\Altium\Datasheets\MOLEX_22-27-2021.pdf; Author: CERN DEM JLC; CreateDate: 04.12.2008; LatestRevisionDate: 04.12.2008
R27 R34 = R0402_10K_1%_0.0625W_100PPM: Resistor - 1%; Part Description: General Purpose Thick Film Chip Resistor; Manufacturer: GENERIC; Manufacturer1 Part Number: 232270671003L; TC: ±100ppm/°C; PressFit: No; Part Number: R0402_10K_1%_0.0625W_100PPM; Component Kind: Standard; Component Type: Standard; Pin Count: 2; Value: 10k; Status: Not Recommended; Power: 0.0625W; Tolerance: ±1%; Manufacturer Part Number: R0402_10K_1%_0.0625W_100PPM; Case: 0402; Mounted: Yes; Sense: No; Socket: No; SMD: Yes; Manufacturer1 Example: YAGEO PHYCOMP; Manufacturer1 ComponentHeight: 0.4mm; HelpURL: \\cern.ch\dfs\Applications\Altium\Datasheets\R0402_Phycomp_RC0402.pdf; Author: CERN DEM JLC; CreateDate: 03.12.2007; LatestRevisionDate: 17.10.2012
R35 R36 R273 = R0402_1K_1%_0.0625W_100PPM: Resistor - 1%; Part Description: General Purpose Thick Film Chip Resistor; Manufacturer: GENERIC; Manufacturer1 Part Number: 232270671002L; TC: ±100ppm/°C; PressFit: No; Part Number: R0402_1K_1%_0.0625W_100PPM; Component Kind: Standard; Component Type: Standard; Pin Count: 2; Value: 1k; Status: Not Recommended; Power: 0.0625W; Tolerance: ±1%; Manufacturer Part Number: R0402_1K_1%_0.0625W_100PPM; Case: 0402; Mounted: Yes; Sense: No; Socket: No; SMD: Yes; Manufacturer1 Example: YAGEO PHYCOMP; Manufacturer1 ComponentHeight: 0.4mm; HelpURL: \\cern.ch\dfs\Applications\Altium\Datasheets\R0402_Phycomp_RC0402.pdf; Author: CERN DEM JLC
  R35 R36: CreateDate: 03.12.2007; LatestRevisionDate: 17.10.2012; ClassName: Artix
  R273: CreateDate: 2007-12-03; LatestRevisionDate: 2012-10-17
R129 = R0402_200R_1%_0.0625W_100PPM: Resistor - 1%; Part Description: General Purpose Thick Film Chip Resistor; Manufacturer: GENERIC; Manufacturer1 Part Number: 232270672001L; TC: ±100ppm/°C; PressFit: No; Part Number: R0402_200R_1%_0.0625W_100PPM; Component Kind: Standard; Component Type: Standard; Pin Count: 2; Value: 200; Status: Not Recommended; Power: 0.0625W; Tolerance: ±1%; Manufacturer Part Number: R0402_200R_1%_0.0625W_100PPM; Case: 0402; Mounted: Yes; Sense: No; Socket: No; SMD: Yes; Manufacturer1 Example: YAGEO PHYCOMP; Manufacturer1 ComponentHeight: 0.4mm; HelpURL: \\cern.ch\dfs\Applications\Altium\Datasheets\R0402_Phycomp_RC0402.pdf; Author: CERN DEM JLC; CreateDate: 2007-12-03; LatestRevisionDate: 2012-10-17
R271 R272 = R0402_0R_JUMPER: Resistor; Part Description: 1A (0.05R Max DC Resistance) Zero Ohm Jumper; Manufacturer: GENERIC; Manufacturer1 Part Number: 232270591001L; PressFit: No; Part Number: R0402_0R_JUMPER; Component Kind: Standard; Component Type: Standard; Pin Count: 2; Value: 0; Status: Not Recommended; Manufacturer Part Number: R0402_0R_JUMPER; Case: 0402; Mounted: Yes; Socket: No; SMD: Yes; Manufacturer1 Example: YAGEO PHYCOMP; Manufacturer1 ComponentHeight: 0.4mm; HelpURL: \\cern.ch\dfs\Applications\Altium\Datasheets\R0402_Phycomp_RC0402.pdf; Author: CERN DEM JLC; CreateDate: 03.12.2007; LatestRevisionDate: 17.10.2012; Sense: No
T1 = BSS84AK: 50V, 180mA P-Channel Trench MOSFET; Part Description: 50V, 180mA P-channel Trench MOSFET Transistor; Manufacturer: NXP SEMICONDUCTORS; PressFit: No; Bonding: No; Part Number: BSS84AK; Component Kind: Standard; Component Type: Standard; Device: BSS84AK; PackageDescription: SOT23, 0.95mm Pitch; 3 Pin, 1.30mm W X 2.90mm L X 1.10mm H body, IPC Medium Density; Manufacturer Part Number: BSS84AK; Pin Count: 3; Case: SOT23-3; Mounted: Yes; Socket: No; SMD: Yes; Sense: No; ComponentHeight: 1.1mm; HelpURL: \\cern.ch\dfs\Applications\Altium\Datasheets\BSS84AK.pdf; Author: CERN DEM JLC; CreateDate: 16.04.2015; LatestRevisionDate: 16.04.2015
T2 = BSH103: N-CHANNEL MOSFET WITH DIODE; Part Description: 30V 850mA N-Channel Enhancement Mode Field-Effect Transistor; Manufacturer: NEXPERIA; PressFit: No; Bonding: No; Part Number: BSH103; Component Kind: Standard; Component Type: Standard; Device: BSH103; PackageDescription: SOT23, 0.95mm Pitch; 3 Pin, 1.30mm W X 2.90mm L X 1.10mm H body, IPC Medium Density; Manufacturer Part Number: BSH103; Pin Count: 3; Case: SOT23-3; Mounted: Yes; Socket: No; SMD: Yes; Sense: No; ComponentHeight: 1.1mm; HelpURL: \\cern.ch\dfs\Applications\Altium\Datasheets\BSH103.pdf; Author: CERN DEM JLC; CreateDate: 16.03.2010; LatestRevisionDate: 20.06.2017
W3 = SAMTEC_HTSW-104-23-L-S: 4 Mini Wire-Wrap Contact Strip Header; Part Description: 4 Contacts, Pitch 2.54mm, Single Row  Through Mount Straight Header (Post Lead 5.84mm, Tail Lead 2.92mm, Insulator 2.54mm); Manufacturer: SAMTEC; PressFit: No; Status Comment: High Temperature; Part Number: SAMTEC_HTSW-104-23-L-S; Component Kind: Standard; Component Type: Standard; Pin Count: 4; Family: Header 4; Mounted: Yes; Socket: No; Sense: No; SMD: No; Status: Preferred; Manufacturer Part Number: HTSW-104-23-L-S; ComponentHeight: 8.38mm; HelpURL: \\cern.ch\dfs\Applications\Altium\Datasheets\SAMTEC_HTSW-104-23-L-S.pdf; Author: CERN DEM JLC; CreateDate: 22/02/2018; LatestRevisionDate: 22/02/2018

## Sheet Power_Supplies.SchDoc: EEM FMC Carrier
size 420 x 297 mm; CheckedBy: -; CompanyName: WUT; DrawnBy: Paweł Kulik; Organization: WUT ISE; Address1: Warsaw University of Technology; Address2: Nowowiejska 15/19 00-665 Warsaw; Address3: pawel.kulik@pw.edu.pl; DocumentNumber: 4; SheetNumber: 12; SheetTotal: 13; EDA_Number: ARTIQ; Projet: ARTIQ/Sinara; CheckedDate: -; Title2: Power Supplies; DivGrp: ISE; Designer: Paweł Kulik; ModifiedDate: -; ProjectName: EEM_FMC_Carrier.PrjPCB
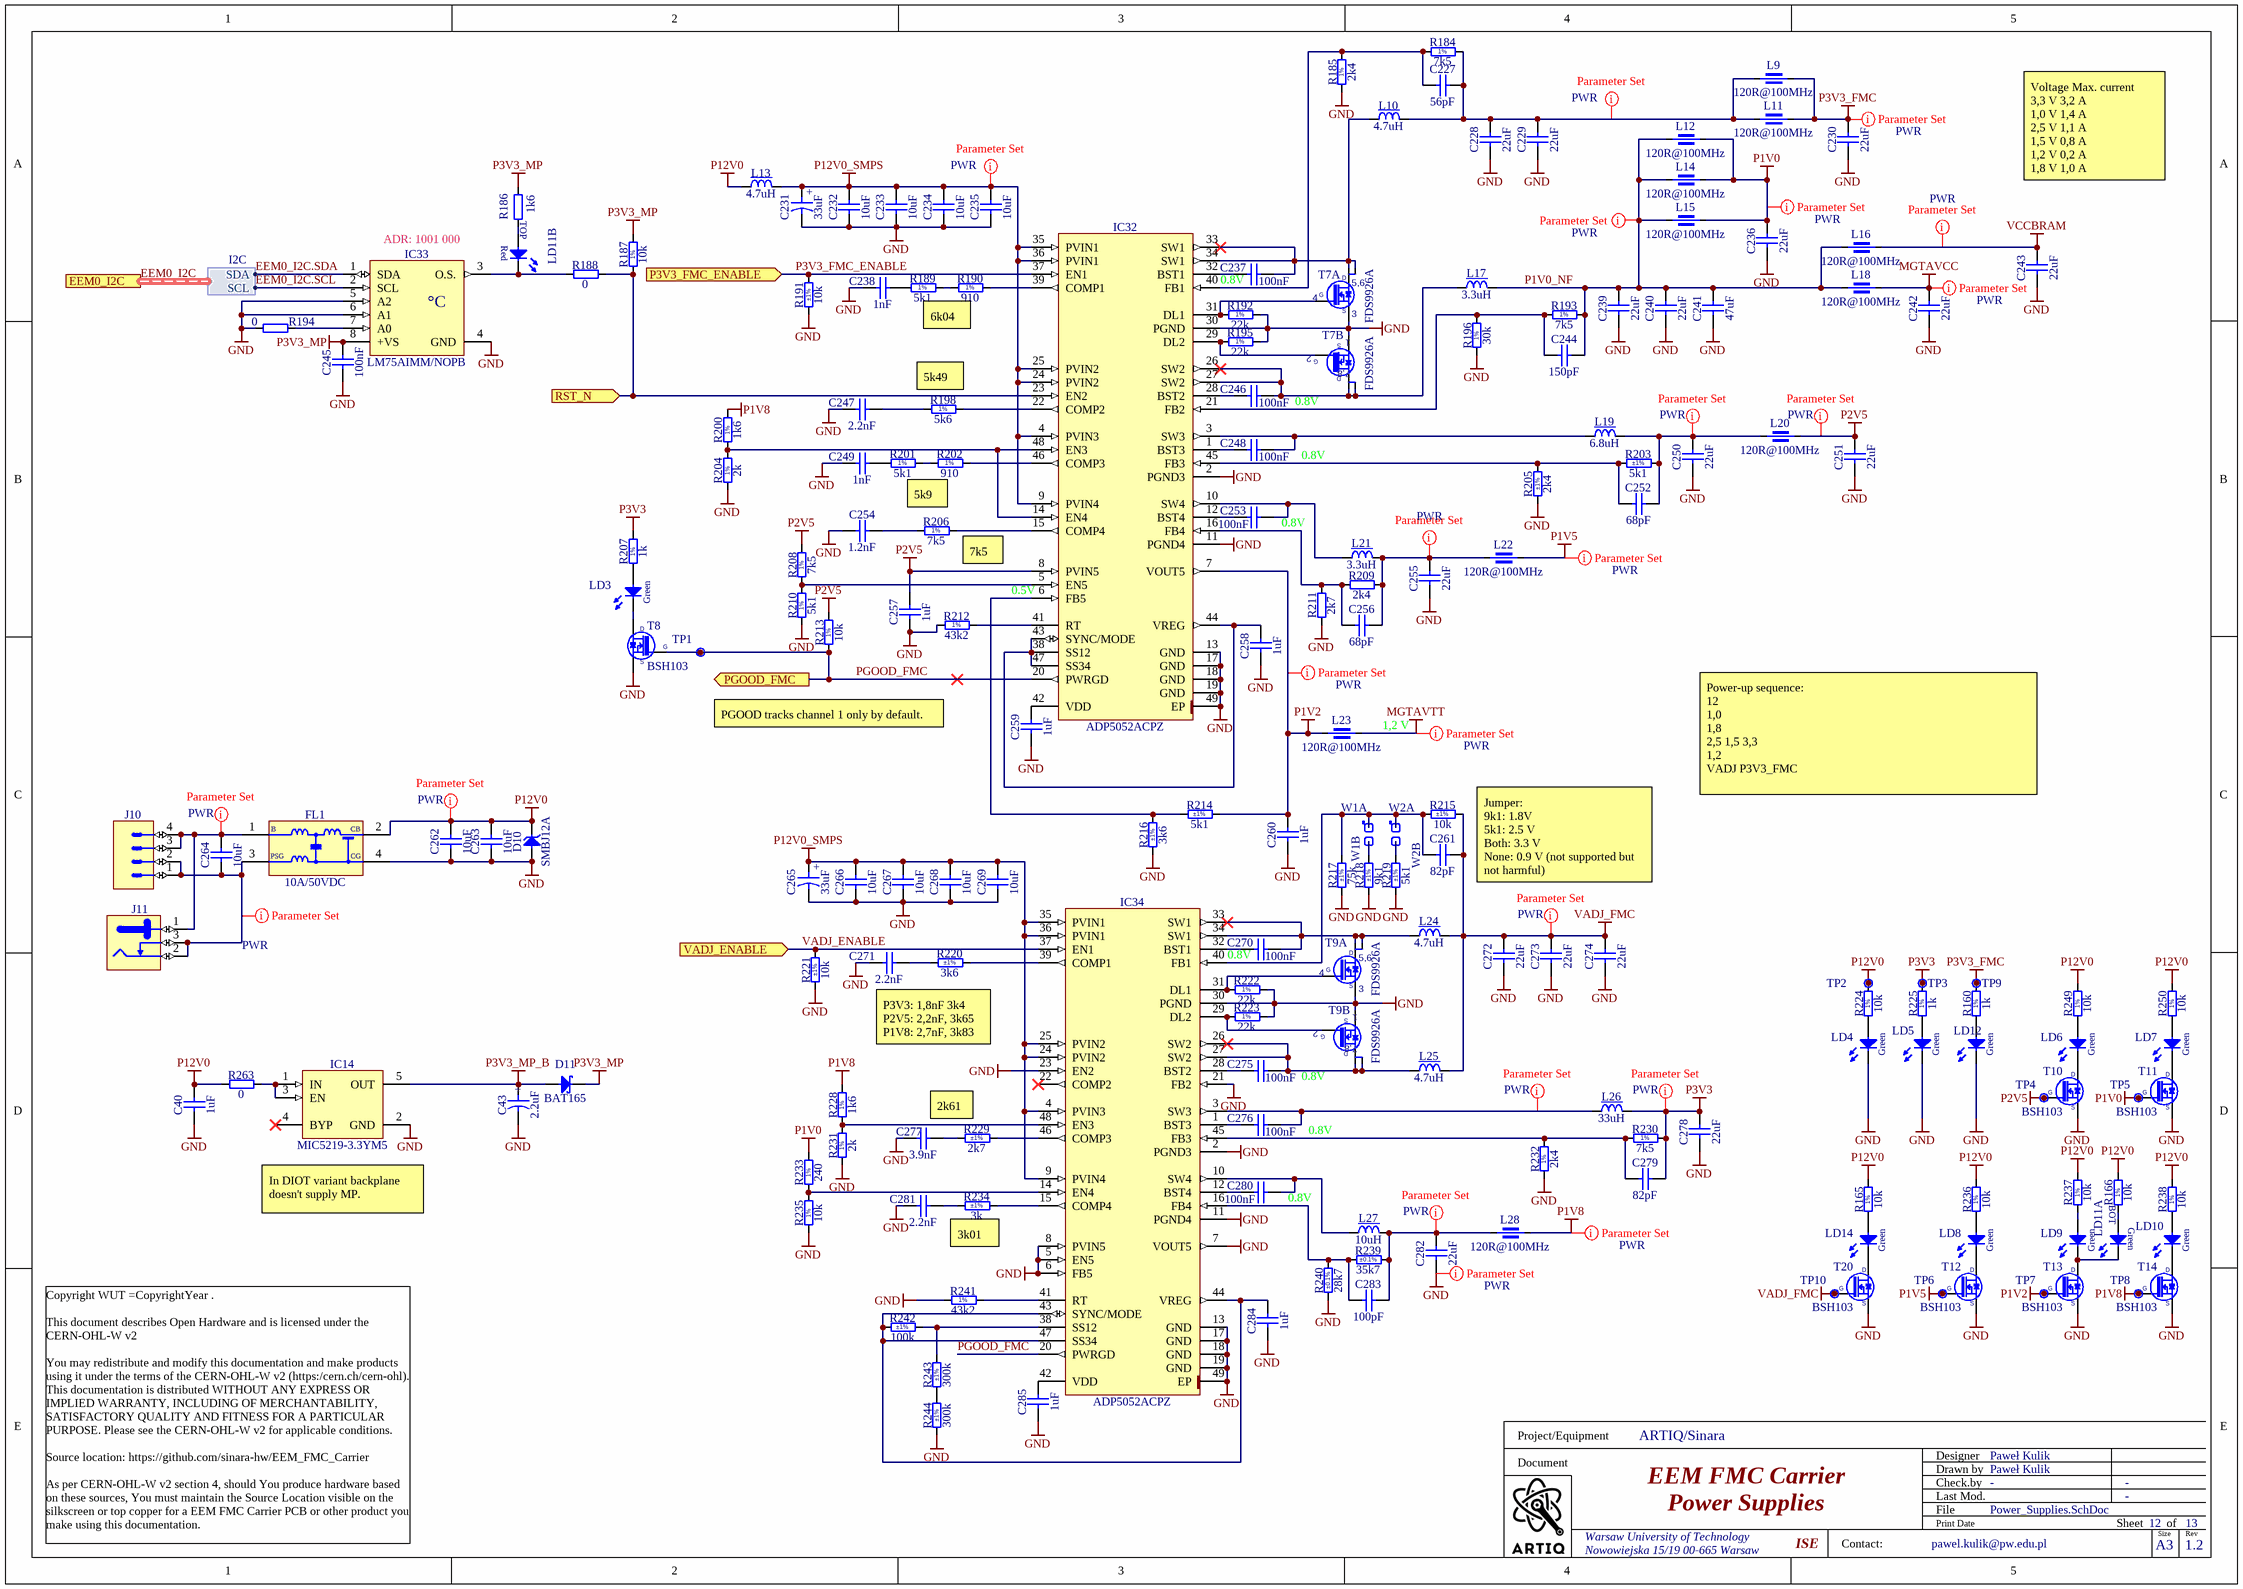
[diagram p2: Power_Supplies.SchDoc]

### Parts
C40  1uF  [CAPC1608X87N]
C43  2.2uF  [CAPMP3216X180N]
C227  56pF  [CAPC1608X87N]
C228  22uF  [CAPC1608X90N]
C229  22uF  [CAPC1608X90N]
C230  22uF  [CAPC1608X90N]
C231  33uF  [CAPMP3528X210N]
C232  10uF  [CAPC2012X95N]
C233  10uF  [CAPC2012X95N]
C234  10uF  [CAPC2012X95N]
C235  10uF  [CAPC2012X95N]
C236  22uF  [CAPC1608X90N]
C237  100nF  [CAPC0603X33N]
C238  1nF  [CAPC1005X55N]
C239  22uF  [CAPC1608X90N]
C240  22uF  [CAPC1608X90N]
C241  47uF  [CAPC1608X100N]
C242  22uF  [CAPC1608X90N]
C243  22uF  [CAPC1608X90N]
C244  150pF  [CAPC1005X55N]
C245  100nF  [CAPC1005X55N]
C246  100nF  [CAPC0603X33N]
C247  2.2nF  [CAPC1005X55N]
C248  100nF  [CAPC0603X33N]
C249  1nF  [CAPC1005X55N]
C250  22uF  [CAPC1608X90N]
C251  22uF  [CAPC1608X90N]
C252  68pF  [CAPC1005X55N]
C253  100nF  [CAPC0603X33N]
C254  1.2nF  [CAPC1608X87N]
C255  22uF  [CAPC1608X90N]
C256  68pF  [CAPC1005X55N]
C257  1uF  [CAPC1005X55N]
C258  1uF  [CAPC1005X55N]
C259  1uF  [CAPC1005X55N]
C260  1uF  [CAPC1005X55N]
C261  82pF  [CAPC1005X55N]
C262  10uF  [CAPC2012X95N]
C263  10uF  [CAPC2012X95N]
C264  10uF  [CAPC2012X95N]
C265  33uF  [CAPMP3528X210N]
C266  10uF  [CAPC2012X95N]
C267  10uF  [CAPC2012X95N]
C268  10uF  [CAPC2012X95N]
C269  10uF  [CAPC2012X95N]
C270  100nF  [CAPC0603X33N]
C271  2.2nF  [CAPC1005X55N]
C272  22uF  [CAPC1608X90N]
C273  22uF  [CAPC1608X90N]
C274  22uF  [CAPC1608X90N]
C275  100nF  [CAPC0603X33N]
C276  100nF  [CAPC0603X33N]
C277  3.9nF  [CAPC1005X55N]
C278  22uF  [CAPC1608X90N]
C279  82pF  [CAPC1005X55N]
C280  100nF  [CAPC0603X33N]
C281  2.2nF  [CAPC1005X55N]
C282  22uF  [CAPC1608X90N]
C283  100pF  [CAPC1005X55N]
C284  1uF  [CAPC1005X55N]
C285  1uF  [CAPC1005X55N]
D10  SMBJ12A  [DIOM5336X265N]
D11  BAT165  [SOD2512X110N]
FL1  10A/50VDC  [FIL_MURATA_BNX02]
IC14  MIC5219-3.3YM5  [SOT95P280X145-5N]
IC32  ADP5052ACPZ  [QFN50P700X700X80-49N-S570]
IC33  LM75AIMM/NOPB  [SOP65P490X109-8N]
IC34  ADP5052ACPZ  [QFN50P700X700X80-49N-S570]
J10  Mini-Fit Jr.™  [MOLEX_39-30-0040]  (value not drawn)
J11  Jack  [SWITCHCRAFT_712RA]  (value not drawn)
L9  120R@100MHz  [INDC1608X65N]
L10  4.7uH  [INDM6965X300N]
L11  120R@100MHz  [INDC1608X65N]
L12  120R@100MHz  [INDC1608X65N]
L13  4.7uH  [INDM6965X300N]
L14  120R@100MHz  [INDC1608X65N]
L15  120R@100MHz  [INDC1608X65N]
L16  120R@100MHz  [INDC1608X65N]
L17  3.3uH  [INDM5552X200N]
L18  120R@100MHz  [INDC1608X65N]
L19  6.8uH  [IND_COILCRAFT_XAL4030]
L20  120R@100MHz  [INDC1608X65N]
L21  3.3uH  [INDM5552X200N]
L22  120R@100MHz  [INDC1608X65N]
L23  120R@100MHz  [INDC1608X65N]
L24  4.7uH  [INDM6965X300N]
L25  4.7uH  [INDM6965X300N]
L26  33uH  [IND_WURTH_WE-TPC_4828]
L27  10uH  [IND_TDK_VLCF5020-1]
L28  120R@100MHz  [INDC1608X65N]
LD3  Green  [LED_KINGBRIGHT_KPH-1608CGCK]
LD4  Green  [LED_KINGBRIGHT_KPH-1608CGCK]
LD5  Green  [LED_KINGBRIGHT_KPH-1608CGCK]
LD6  Green  [LED_KINGBRIGHT_KPH-1608CGCK]
LD7  Green  [LED_KINGBRIGHT_KPH-1608CGCK]
LD8  Green  [LED_KINGBRIGHT_KPH-1608CGCK]
LD9  Green  [LED_KINGBRIGHT_KPH-1608CGCK]
LD10  Green  [LED_KINGBRIGHT_KPH-1608CGCK]
LD11  Red/Green  [LED_DIALIGHT_571-0112F]  (value not drawn)  (parts A,B of 2)
LD12  Green  [LED_KINGBRIGHT_KPH-1608CGCK]
LD14  Green  [LED_KINGBRIGHT_KPH-1608CGCK]
R160  1k  [RESC1005X40N]
R165  10k  [RESC1005X40N]
R166  10k  [RESC1005X40N]
R184  7k5  [RESC1005X40N]
R185  2k4  [RESC1005X40N]
R186  1k6  [RESC1005X40N]
R187  10k  [RESC1005X40N]
R188  0  [RESC1005X40N]
R189  5k1  [RESC1005X40N]
R190  910  [RESC1005X40N]
R191  10k  Tolerance: ±1%  [RESC1005X40N]
R192  22k  [RESC1005X40N]
R193  7k5  [RESC1005X40N]
R194  0  [RESC1005X40N]
R195  22k  [RESC1005X40N]
R196  30k  [RESC1005X40N]
R198  5k6  [RESC1005X40N]
R200  1k6  [RESC1005X40N]
R201  5k1  [RESC1005X40N]
R202  910  [RESC1005X40N]
R203  5k1  Tolerance: ±1%  [RESC1005X40N]
R204  2k  [RESC1005X40N]
R205  2k4  Tolerance: ±1%  [RESC1005X40N]
R206  7k5  [RESC1005X40N]
R207  1k  [RESC1005X40N]
R208  7k5  [RESC1005X40N]
R209  2k4  [RESC1005X40N]
R210  5k1  [RESC1005X40N]
R211  2k7  [RESC1608X55N]
R212  43k2  [RESC1005X35N]
R213  10k  [RESC1005X40N]
R214  5k1  Tolerance: ±1%  [RESC1005X40N]
R215  10k  Tolerance: ±1%  [RESC1005X40N]
R216  3k6  Tolerance: ±1%  [RESC1005X40N]
R217  75k  Tolerance: ±1%  [RESC1005X40N]
R218  9k1  Tolerance: ±1%  [RESC1005X40N]
R219  5k1  Tolerance: ±1%  [RESC1005X40N]
R220  3k6  Tolerance: ±1%  [RESC1005X40N]
R221  10k  Tolerance: ±1%  [RESC1005X40N]
R222  22k  [RESC1005X40N]
R223  22k  [RESC1005X40N]
R224  10k  [RESC1005X40N]
R225  1k  [RESC1005X40N]
R228  1k6  [RESC1005X40N]
R229  2k7  Tolerance: ±1%  [RESC1608X55N]
R230  7k5  [RESC1005X40N]
R231  2k  [RESC1005X40N]
R232  2k4  [RESC1005X40N]
R233  240  [RESC1005X40N]
R234  3k  Tolerance: ±1%  [RESC1005X40N]
R235  10k  [RESC1005X40N]
R236  10k  [RESC1005X40N]
R237  10k  [RESC1005X40N]
R238  10k  [RESC1005X40N]
R239  35k7  Tolerance: ±0.1%  [RESC1608X55N]
R240  28k7  Tolerance: ±0.1%  [RESC1608X55N]
R241  43k2  [RESC1005X35N]
R242  100k  Tolerance: ±1%  [RESC1005X40N]
R243  300k  Tolerance: ±1%  [RESC1005X40N]
R244  300k  Tolerance: ±1%  [RESC1005X40N]
R249  10k  [RESC1005X40N]
R250  10k  [RESC1005X40N]
R263  0  [RESC1005X40N]
T7  FDS9926A  [SOIC127P600X175-8N]  (parts A,B of 2)
T8  BSH103  [SOT95P230X110-3N]
T9  FDS9926A  [SOIC127P600X175-8N]  (parts A,B of 2)
T10  BSH103  [SOT95P230X110-3N]
T11  BSH103  [SOT95P230X110-3N]
T12  BSH103  [SOT95P230X110-3N]
T13  BSH103  [SOT95P230X110-3N]
T14  BSH103  [SOT95P230X110-3N]
T20  BSH103  [SOT95P230X110-3N]
TP1  Power Good  [TPS127]  (value not drawn)  (no BOM)
TP2  P12V0  [TPS127]  (value not drawn)  (no BOM)
TP3  P3V3  [TPS127]  (value not drawn)  (no BOM)
TP4  P2V5  [TPS127]  (value not drawn)  (no BOM)
TP5  P1V0  [TPS127]  (value not drawn)  (no BOM)
TP6  P1V5  [TPS127]  (value not drawn)  (no BOM)
TP7  P1V2  [TPS127]  (value not drawn)  (no BOM)
TP8  P1V8  [TPS127]  (value not drawn)  (no BOM)
TP9  P3V3  [TPS127]  (value not drawn)  (no BOM)
TP10  P1V8  [TPS127]  (value not drawn)  (no BOM)
W1  Header 2  [SAMTEC_MTLW-102-07-L-S-250]  (value not drawn)  (parts A,B of 2)
W2  Header 2  [SAMTEC_MTLW-102-07-L-S-250]  (value not drawn)  (parts A,B of 2)

### Ports
EEM0_I2C (harness I2C), P3V3_FMC_ENABLE (in), PGOOD_FMC (out), RST_N (in), VADJ_ENABLE (in)

### Harnesses
I2C: SDA, SCL

### Nets
GND: C40.1 C43.2 C228.1 C229.1 C230.1 C231.2 C232.1 C233.1 C234.1 C235.1 C236.1 C238.1 C239.1 C240.1 C241.1 C242.1 C243.1 C245.1 C247.1 C249.1 C250.1 C251.1 C254.1 C255.1 C257.1 C258.1 C259.1 C260.1 C262.1 C263.1 C265.2 C266.1 C267.1 C268.1 C269.1 C271.1 C272.1 C273.1 C274.1 C277.1 C278.1 C281.1 C282.1 C284.1 C285.1 D10.2(A) FL1.4(CG) IC14.2(GND) IC32.2(PGND3) IC32.11(PGND4) IC32.13(GND) IC32.17(GND) IC32.18(GND) IC32.19(GND) IC32.30(PGND) IC32.49(EP) IC33.4(GND) IC33.5(A2) IC33.6(A1) IC34.2(PGND3) IC34.5(EN5) IC34.6(FB5) IC34.7(VOUT5) IC34.8(PVIN5) IC34.11(PGND4) IC34.13(GND) IC34.17(GND) IC34.18(GND) IC34.19(GND) IC34.21(FB2) IC34.23(EN2) IC34.30(PGND) IC34.49(EP) LD4.1(C) LD5.1(C) LD12.1(C) R185.1 R191.1 R192.2 R194.1 R195.2 R196.1 R204.1 R205.1 R210.1 R211.1 R212.1 R216.1 R217.1 R218.1 R219.1 R221.1 R222.2 R223.2 R231.1 R232.1 R235.1 R240.1 R241.1 R244.1 T7.1(S) T7.3(S) T8.2(S) T9.1(S) T9.3(S) T10.2(S) T11.2(S) T12.2(S) T13.2(S) T14.2(S) T20.2(S)
MGTAVCC: C242.2 L18.2
MGTAVTT: L23.2
P1V0: C236.2 L12.2 L14.2 L15.2 R233.2 T11.1(G) TP5.1
P1V2: C260.2 IC32.7(VOUT5) L23.1 R214.2 T13.1(G) TP7.1
P1V5: L22.2 T12.1(G) TP6.1
P1V8: L28.2 R200.2 R228.2 T14.1(G) TP8.1
P2V5: C251.2 C257.2 IC32.8(PVIN5) L20.2 R208.2 R213.2 T10.1(G) TP4.1
P3V3: C278.2 C279.2 L26.2 R207.2 R225.2 R230.2 TP3.1
P3V3_FMC: C230.2 L9.2 L11.2 R160.2 TP9.1
P3V3_MP: C245.2 D11.1(C) IC33.8(+VS) R186.2 R187.2
P3V3_MP_B: C43.1 D11.2(A) IC14.5(OUT)
P12V0: C40.2 C262.2 C263.2 D10.1(C) FL1.2(CB) L13.1 R165.2 R166.2 R224.2 R236.2 R237.2 R238.2 R249.2 R250.2 R263.1 TP2.1
P12V0_SMPS: C231.1 C232.2 C233.2 C234.2 C235.2 C265.1 C266.2 C267.2 C268.2 C269.2 IC32.4(PVIN3) IC32.9(PVIN4) IC32.24(PVIN2) IC32.25(PVIN2) IC32.35(PVIN1) IC32.36(PVIN1) IC34.4(PVIN3) IC34.9(PVIN4) IC34.24(PVIN2) IC34.25(PVIN2) IC34.35(PVIN1) IC34.36(PVIN1) L13.2
VADJ_FMC: C261.2 C272.2 C273.2 C274.2 L24.2 L25.2 R215.2 T20.1(G) TP10.1
VCCBRAM: C243.2 L16.2
EEM0_I2C.SCL: IC33.2(SCL) ; port EEM0_I2C.SCL
EEM0_I2C.SDA: IC33.1(SDA) ; port EEM0_I2C.SDA
P1V0_NF: C239.2 C240.2 C241.2 C244.2 L12.1 L14.1 L15.1 L16.1 L17.2 L18.1 R193.2
P3V3_FMC_ENABLE: IC32.37(EN1) R191.2 ; port P3V3_FMC_ENABLE
PGOOD_FMC: IC32.20(PWRGD) IC34.20(PWRGD) R213.1 T8.1(G) TP1.1 ; port PGOOD_FMC
RST_N: IC32.23(EN2) R187.1 R188.2 ; port RST_N
VADJ_ENABLE: IC34.37(EN1) R221.2 ; port VADJ_ENABLE
NetC227_1: C227.1 IC32.40(FB1) R184.1 R185.2
NetC227_2: C227.2 C228.2 C229.2 L9.1 L10.2 L11.1 R184.2
NetC237_1: C237.1 IC32.33(SW1) IC32.34(SW1) L10.1 T7.5(D) T7.6(D)
NetC237_2: C237.2 IC32.32(BST1)
NetC238_2: C238.2 R189.1
NetC244_1: C244.1 IC32.21(FB2) R193.1 R196.2
NetC246_1: C246.1 IC32.26(SW2) IC32.27(SW2) L17.1 T7.7(D) T7.8(D)
NetC246_2: C246.2 IC32.28(BST2)
NetC247_2: C247.2 R198.1
NetC248_1: C248.1 IC32.3(SW3) L19.1
NetC248_2: C248.2 IC32.1(BST3)
NetC249_2: C249.2 R201.1
NetC250_2: C250.2 C252.2 L19.2 L20.1 R203.2
NetC252_1: C252.1 IC32.45(FB3) R203.1 R205.2
NetC253_1: C253.1 IC32.10(SW4) L21.1
NetC253_2: C253.2 IC32.12(BST4)
NetC254_2: C254.2 R206.1
NetC255_2: C255.2 C256.2 L21.2 L22.1 R209.2
NetC256_1: C256.1 IC32.16(FB4) R209.1 R211.2
NetC258_2: C258.2 IC32.38(SS12) IC32.43(SYNC/MODE) IC32.44(VREG) IC32.47(SS34)
NetC259_2: C259.2 IC32.42(VDD)
NetC261_1: C261.1 IC34.40(FB1) R215.1 R217.2 W1.1 W2.1
NetC264_1: C264.1 FL1.3(PSG) J10.1 J10.2 J11.2 J11.3
NetC264_2: C264.2 FL1.1(B) J10.3 J10.4 J11.1
NetC270_1: C270.1 IC34.33(SW1) IC34.34(SW1) L24.1 T9.5(D) T9.6(D)
NetC270_2: C270.2 IC34.32(BST1)
NetC271_2: C271.2 R220.1
NetC275_1: C275.1 IC34.26(SW2) IC34.27(SW2) L25.1 T9.7(D) T9.8(D)
NetC275_2: C275.2 IC34.28(BST2)
NetC276_1: C276.1 IC34.3(SW3) L26.1
NetC276_2: C276.2 IC34.1(BST3)
NetC277_2: C277.2 R229.1
NetC279_1: C279.1 IC34.45(FB3) R230.1 R232.2
NetC280_1: C280.1 IC34.10(SW4) L27.1
NetC280_2: C280.2 IC34.12(BST4)
NetC281_2: C281.2 R234.1
NetC282_2: C282.2 C283.2 L27.2 L28.1 R239.2
NetC283_1: C283.1 IC34.16(FB4) R239.1 R240.2
NetC284_2: C284.2 IC34.43(SYNC/MODE) IC34.44(VREG) IC34.47(SS34) R242.1
NetC285_2: C285.2 IC34.42(VDD)
NetIC14_1: IC14.1(IN) IC14.3(EN) R263.2
NetIC32_5: IC32.5(EN5) R208.1 R210.2
NetIC32_6: IC32.6(FB5) R214.1 R216.2
NetIC32_14: IC32.14(EN4) IC32.48(EN3) R200.1 R204.2
NetIC32_15: IC32.15(COMP4) R206.2
NetIC32_22: IC32.22(COMP2) R198.2
NetIC32_29: IC32.29(DL2) R195.1 T7.2(G)
NetIC32_31: IC32.31(DL1) R192.1 T7.4(G)
NetIC32_39: IC32.39(COMP1) R190.2
NetIC32_41: IC32.41(RT) R212.2
NetIC32_46: IC32.46(COMP3) R202.2
NetIC33_3: IC33.3(O.S.) LD11.3(C) R188.1
NetIC33_7: IC33.7(A0) R194.2
NetIC34_14: IC34.14(EN4) R233.1 R235.2
NetIC34_15: IC34.15(COMP4) R234.2
NetIC34_29: IC34.29(DL2) R223.1 T9.2(G)
NetIC34_31: IC34.31(DL1) R222.1 T9.4(G)
NetIC34_38: IC34.38(SS12) R242.2 R243.2
NetIC34_39: IC34.39(COMP1) R220.2
NetIC34_41: IC34.41(RT) R241.2
NetIC34_46: IC34.46(COMP3) R229.2
NetIC34_48: IC34.48(EN3) R228.1 R231.2
NetLD3_1: LD3.1(C) T8.3(D)
NetLD3_2: LD3.2(A) R207.1
NetLD4_2: LD4.2(A) R224.1
NetLD5_2: LD5.2(A) R225.1
NetLD6_1: LD6.1(C) T10.3(D)
NetLD6_2: LD6.2(A) R249.1
NetLD7_1: LD7.1(C) T11.3(D)
NetLD7_2: LD7.2(A) R250.1
NetLD8_1: LD8.1(C) T12.3(D)
NetLD8_2: LD8.2(A) R236.1
NetLD9_1: LD9.1(C) LD11.1(C) T13.3(D)
NetLD9_2: LD9.2(A) R237.1
NetLD10_1: LD10.1(C) T14.3(D)
NetLD10_2: LD10.2(A) R238.1
NetLD11_2: LD11.2(A) R166.1
NetLD11_4: LD11.4(A) R186.1
NetLD12_2: LD12.2(A) R160.1
NetLD14_1: LD14.1(C) T20.3(D)
NetLD14_2: LD14.2(A) R165.1
NetR189_2: R189.2 R190.1
NetR201_2: R201.2 R202.1
NetR218_2: R218.2 W1.2
NetR219_2: R219.2 W2.2
NetR243_1: R243.1 R244.2

Not connected (* = marked no-connect by the designer): IC14 4(BYP)*; IC34 22(COMP2)*

### Buses and harness runs
harness EEM0_I2C = port EEM0_I2C

### Layout directives
net class PWR: GND, MGTAVCC, MGTAVTT, NetC227_2, NetC250_2, NetC255_2, NetC264_1, NetC264_2, NetC276_1, NetC282_2, P1V0, P1V0_NF, P1V2, P1V5, P1V8, P2V5, P3V3, P3V3_FMC, P12V0, P12V0_SMPS, VADJ_FMC, VCCBRAM

### Notes on the sheet
- Voltage	Max. current
  3,3 V	3,2 A
  1,0 V	1,4 A
  2,5 V	1,1 A
  1,5 V	0,8 A
  1,2 V	0,2 A
  1,8 V	1,0 A
- (near IC33) ADR: 1001 000
- 6k04
- (near C237) 0.8V
- (near R198) 5k49
- (near T7) 0.8V
- (near C248) 0.8V
- 5k9
- (near C253) 0.8V
- (near R206) 7k5
- (near IC32) 0.5V
- PGOOD tracks channel 1 only by default.
- (near L23) 1,2 V
- Power-up sequence:
  12
  1,0
  1,8
  2,5 1,5 3,3
  1,2
  VADJ P3V3_FMC
- Jumper:
  9k1: 1.8V
  5k1: 2.5 V
  Both: 3.3 V
  None: 0.9 V (not supported but not harmful)
- (near C270) 0.8V
- P3V3: 1,8nF 3k4
  P2V5: 2,2nF, 3k65
  P1V8: 2,7nF, 3k83
- 2k61
- (near T9) 0.8V
- (near C276) 0.8V
- (near IC14) In DIOT variant backplane doesn't supply MP.
- (near C280) 0.8V
- (near R234) 3k01
- Project/Equipment
- Document
- Designer
- Drawn by
- Check.by
- Copyright WUT =CopyrightYear .
  This document describes Open Hardware and is licensed under the CERN-OHL-W v2
  You may redistribute and modify this documentation and make products using it under the terms of the CERN-OHL-W v2 (https:/cern.ch/cern-ohl). This documentation is distributed WITHOUT ANY EXPRESS OR IMPLIED WARRANTY, INCLUDING OF MERCHANTABILITY, SATISFACTORY QUALITY AND FITNESS FOR A PARTICULAR PURPOSE. Please see the CERN-OHL-W v2 for applicable conditions.
  Source location: https://github.com/sinara-hw/EEM_FMC_Carrier
  As per CERN-OHL-W v2 section 4, should You produce hardware based on these sources, You must maintain the Source Location visible on the silkscreen or top copper for a EEM FMC Carrier PCB or other product you make using this documentation.
- Contact:
- File
- Last Mod.
- Print Date
- Sheet
- Size
- A3
- of
- Rev
- (in symbol 43k2 1% 0402) 1%
- (in symbol CTE3216-18_2.2UF_25V_10%) +
- (in symbol CTE3528-21_33UF_16V_10%) +
- (in symbol FDS9926A, part A) 5,6
- (in symbol FDS9926A, part B) 7,8
- (in symbol LED_DIALIGHT_571-0112F, part A) BOT; Green
- (in symbol LED_DIALIGHT_571-0112F, part B) TOP; Red
- (in symbol LM75AIMM/NOPB) °C
- (in symbol R0402_1K6_1%_0.0625W_100PPM) 1%
- (in symbol R0402_1K_1%_0.0625W_100PPM) 1%
- (in symbol R0402_2K4_1%_0.0625W_100PPM) 1%
- (in symbol R0402_2K_1%_0.0625W_100PPM) 1%
- (in symbol R0402_5K1_1%_0.0625W_100PPM) 1%
- (in symbol R0402_5K6_1%_0.0625W_100PPM) 1%
- (in symbol R0402_7K5_1%_0.0625W_100PPM) 1%
- (in symbol R0402_10K_1%_0.0625W_100PPM) 1%
- (in symbol R0402_22K_1%_0.0625W_100PPM) 1%
- (in symbol R0402_30K_1%_0.0625W_100PPM) 1%
- (in symbol R0402_240R_1%_0.0625W_100PPM) 1%
- (in symbol R0402_910R_1%_0.0625W_100PPM) 1%